# EAGLE design rat (EAGLE 6.3)
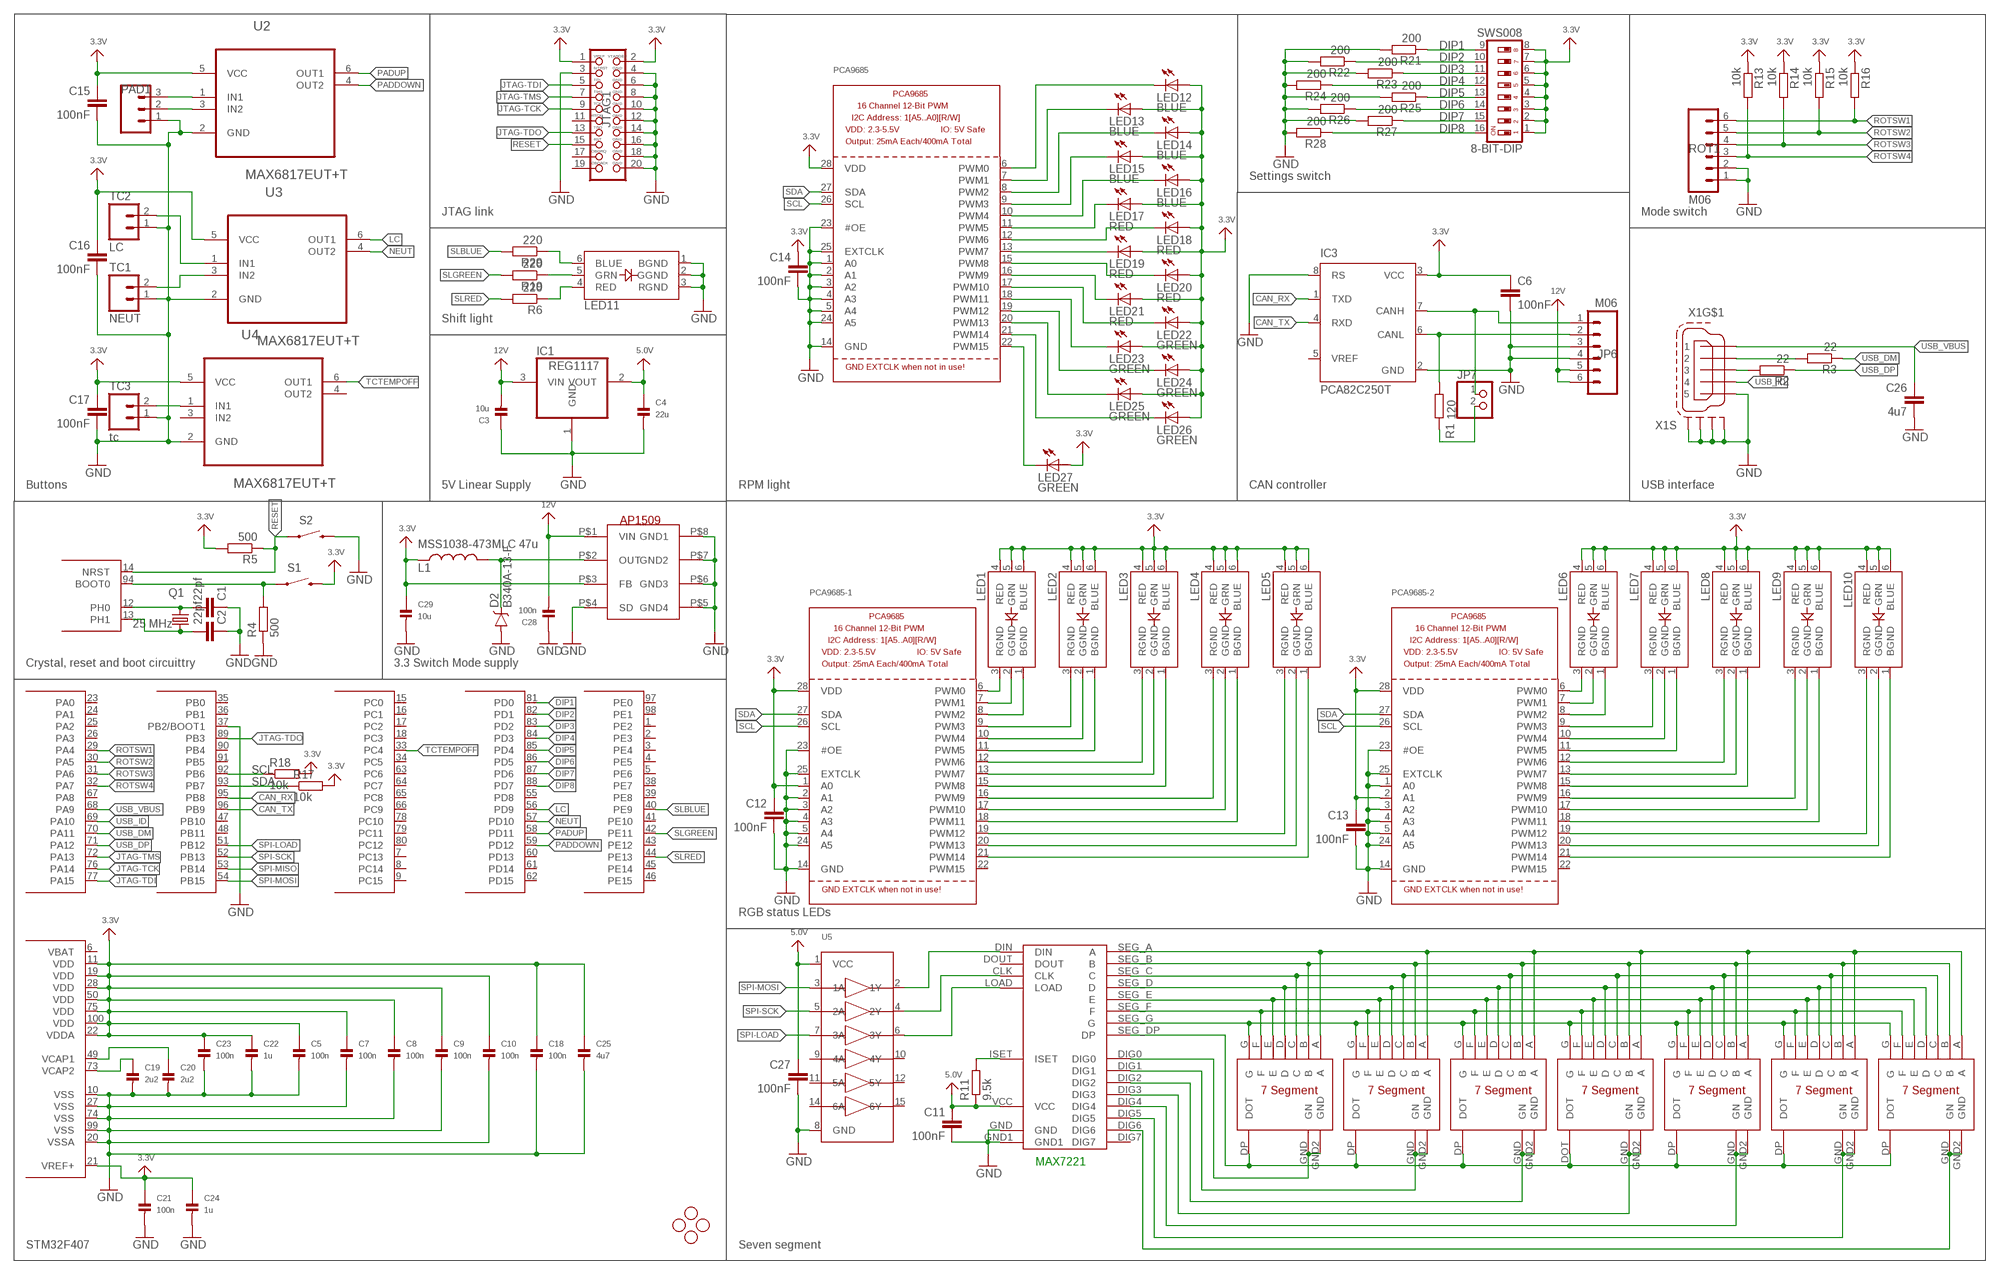
[diagram p0: schematic, sheet 1]

## Parts
8-BIT-DIP  SWS008  [SMS-008]
C1  22pf  C-EUC0603K  [C0603K]
C2  22pf  C-EUC0603K  [C0603K]
C3  10u  CAP_CERAMIC0805  [0805]
C4  22u  CAP_CERAMIC_0603MP  [_0603MP]
C5  100n  CAP_CERAMIC_0402MP  [_0402MP]
C6  100nF  C-EUC0603K  [C0603K]
C7  100n  CAP_CERAMIC_0402MP  [_0402MP]
C8  100n  CAP_CERAMIC_0402MP  [_0402MP]
C9  100n  CAP_CERAMIC_0402MP  [_0402MP]
C10  100n  CAP_CERAMIC_0402MP  [_0402MP]
C11  100nF  C-EUC0603K  [C0603K]
C12  100nF  C-EUC0603K  [C0603K]
C13  100nF  C-EUC0603K  [C0603K]
C14  100nF  C-EUC0603K  [C0603K]
C15  100nF  C-EUC0603K  [C0603K]
C16  100nF  C-EUC0603K  [C0603K]
C17  100nF  C-EUC0603K  [C0603K]
C18  100n  CAP_CERAMIC_0402MP  [_0402MP]
C19  2u2  CAP_CERAMIC_0402MP  [_0402MP]
C20  2u2  CAP_CERAMIC_0402MP  [_0402MP]
C21  100n  CAP_CERAMIC_0402MP  [_0402MP]
C22  1u  CAP_CERAMIC_0402MP  [_0402MP]
C23  100n  CAP_CERAMIC_0402MP  [_0402MP]
C24  1u  CAP_CERAMIC_0402MP  [_0402MP]
C25  4u7  CAP_CERAMIC_0402MP  [_0402MP]
C26  4u7  C-EUC0603K  [C0603K]
C27  100nF  C-EUC0603K  [C0603K]
C28  100n  CAP_CERAMIC_0603MP  [_0603MP]
C29  10u  CAP_CERAMIC0805  [0805]
D2  B340A-13-F  MBRA140  [SMA-DIODE]
IC1  REG1117  [SOT223]
IC3  PCA82C250T  [SO8]
JP2  STAND-OFF  [STAND-OFF]
JP3  STAND-OFF  [STAND-OFF]
JP4  STAND-OFF  [STAND-OFF]
JP5  STAND-OFF  [STAND-OFF]
JP6  M06  [S6B_PH]
JP7  PINHD-1X2/90  [1X02/90]
JTAG1  JTAG-ARMEDGE  [MOLEX20_RIGHTANGLE]
L1  MSS1038-473MLC 47u  INDUCTORPWR  [CDRH125]
LED1  LED_RGB_PLCC6CREE-CLV6A  [RGBLED_PLCC6]
LED2  LED_RGB_PLCC6CREE-CLV6A  [RGBLED_PLCC6]
LED3  LED_RGB_PLCC6CREE-CLV6A  [RGBLED_PLCC6]
LED4  LED_RGB_PLCC6CREE-CLV6A  [RGBLED_PLCC6]
LED5  LED_RGB_PLCC6CREE-CLV6A  [RGBLED_PLCC6]
LED6  LED_RGB_PLCC6CREE-CLV6A  [RGBLED_PLCC6]
LED7  LED_RGB_PLCC6CREE-CLV6A  [RGBLED_PLCC6]
LED8  LED_RGB_PLCC6CREE-CLV6A  [RGBLED_PLCC6]
LED9  LED_RGB_PLCC6CREE-CLV6A  [RGBLED_PLCC6]
LED10  LED_RGB_PLCC6CREE-CLV6A  [RGBLED_PLCC6]
LED11  LED_RGB_PLCC6CREE-CLV6A  [RGBLED_PLCC6]
LED12  BLUE  LEDSMT1206  [1206]
LED13  BLUE  LEDSMT1206  [1206]
LED14  BLUE  LEDSMT1206  [1206]
LED15  BLUE  LEDSMT1206  [1206]
LED16  BLUE  LEDSMT1206  [1206]
LED17  RED  LEDSMT1206  [1206]
LED18  RED  LEDSMT1206  [1206]
LED19  RED  LEDSMT1206  [1206]
LED20  RED  LEDSMT1206  [1206]
LED21  RED  LEDSMT1206  [1206]
LED22  GREEN  LEDSMT1206  [1206]
LED23  GREEN  LEDSMT1206  [1206]
LED24  GREEN  LEDSMT1206  [1206]
LED25  GREEN  LEDSMT1206  [1206]
LED26  GREEN  LEDSMT1206  [1206]
LED27  GREEN  LEDSMT1206  [1206]
MAX7221  MAX7221-SMD  [MAX7221]
PAD1  M03  [S3B-PH]
PCA9685  PCA9685  [TSSOP28]
PCA9685-1  PCA9685  [TSSOP28]
PCA9685-2  PCA9685  [TSSOP28]
Q1  25 MHz  CRYSTALHC49U70  [HC49U70]
R1  120  R-EU_R0603  [R0603]
R2  22  R-EU_R0603  [R0603]
R3  22  R-EU_R0603  [R0603]
R4  500  R-EU_R0603  [R0603]
R5  500  R-EU_R0603  [R0603]
R6  220  R-EU_R0603  [R0603]
R11  9.5k  R-EU_R0603  [R0603]
R13  10k  R-EU_R0603  [R0603]
R14  10k  R-EU_R0603  [R0603]
R15  10k  R-EU_R0603  [R0603]
R16  10k  R-EU_R0603  [R0603]
R17  10k  R-EU_R0603  [R0603]
R18  10k  R-EU_R0603  [R0603]
R19  220  R-EU_R0603  [R0603]
R21  200  R-EU_R0603  [R0603]
R22  200  R-EU_R0603  [R0603]
R23  200  R-EU_R0603  [R0603]
R24  200  R-EU_R0603  [R0603]
R25  200  R-EU_R0603  [R0603]
R26  200  R-EU_R0603  [R0603]
R27  200  R-EU_R0603  [R0603]
R28  200  R-EU_R0603  [R0603]
R29  220  R-EU_R0603  [R0603]
ROT1  M06  [S6B_PH]
S1  SWITCH-MOMENTARY-2-SMD-1101NE  [TACTILE-SWITCH-1101NE]
S2  SWITCH-MOMENTARY-2-SMD-1101NE  [TACTILE-SWITCH-1101NE]
TC1  NEUT  M02-JST-2MM-SMT  [S2B-PH]
TC2  LC  M02-JST-2MM-SMT  [S2B-PH]
TC3  tc  M02-JST-2MM-SMT  [S2B-PH]
U1  STM32F4-100  [SQFP-S-14X14-100]
U2  MAX6817EUT+T  [SOT95P280X145-6N]
U3  MAX6817EUT+T  [SOT95P280X145-6N]
U4  MAX6817EUT+T  [SOT95P280X145-6N]
U5  74HC4050D  [SOIC16]
U$2  REDSEVENSEGMENT  [REDSEGMENT]
U$3  REDSEVENSEGMENT  [REDSEGMENT]
U$4  REDSEVENSEGMENT  [REDSEGMENT]
U$5  BIGSEVENSEGMENT  [BIGSEVENSEGMENT]
U$6  REDSEVENSEGMENT  [REDSEGMENT]
U$7  REDSEVENSEGMENT  [REDSEGMENT]
U$8  REDSEVENSEGMENT  [REDSEGMENT]
U$10  AP1509  [SOP-8L]
X1  MINI-USB-SCHIELD-32005-201  [32005-201]

## Nets
3.3V: 8-BIT-DIP.1 8-BIT-DIP.2 8-BIT-DIP.3 8-BIT-DIP.4 8-BIT-DIP.5 8-BIT-DIP.6 8-BIT-DIP.7 8-BIT-DIP.8 C5.1 C6.1 C7.1 C8.1 C9.1 C10.1 C12.1 C13.1 C14.1 C15.1 C16.1 C17.1 C18.1 C21.1 C22.1 C23.1 C24.1 C25.1 C29.1 IC3.3(VCC) JTAG1.1 JTAG1.2 L1.1 LED1.4(RED) LED1.5(GRN) LED1.6(BLUE) LED2.4(RED) LED2.5(GRN) LED2.6(BLUE) LED3.4(RED) LED3.5(GRN) LED3.6(BLUE) LED4.4(RED) LED4.5(GRN) LED4.6(BLUE) LED5.4(RED) LED5.5(GRN) LED5.6(BLUE) LED6.4(RED) LED6.5(GRN) LED6.6(BLUE) LED7.4(RED) LED7.5(GRN) LED7.6(BLUE) LED8.4(RED) LED8.5(GRN) LED8.6(BLUE) LED9.4(RED) LED9.5(GRN) LED9.6(BLUE) LED10.4(RED) LED10.5(GRN) LED10.6(BLUE) LED12.A LED13.A LED14.A LED15.A LED16.A LED17.A LED18.A LED19.A LED20.A LED21.A LED22.A LED23.A LED24.A LED25.A LED26.A LED27.A PCA9685-1.1(A0) PCA9685-1.28(VDD) PCA9685-2.2(A1) PCA9685-2.28(VDD) PCA9685.28(VDD) R5.2 R13.1 R14.1 R15.1 R16.1 R17.2 R18.2 S1.P$2 U1.11(VDD) U1.19(VDD) U1.21(VREF+) U1.22(VDDA) U1.28(VDD) U1.50(VDD) U1.75(VDD) U1.100(VDD) U2.5(VCC) U3.5(VCC) U4.5(VCC) U$10.P$3(FB)
5.0V: C4.1 C11.1 C27.1 IC1.2(VOUT) MAX7221.VCC R11.1 U5.1(VCC)
12V: C3.2 C28.2 IC1.3(VIN) JP6.5 JP6.6 U$10.P$1(VIN)
CAN_RX: IC3.1(TXD) U1.95(PB8)
CAN_TX: IC3.4(RXD) U1.96(PB9)
CANJUMP1: IC3.7(CANH) JP6.1 JP7.1
CANJUMP2: JP7.2 R1.2
DIP1: 8-BIT-DIP.9 R21.1 U1.81(PD0)
DIP2: 8-BIT-DIP.10 R22.1 U1.82(PD1)
DIP3: 8-BIT-DIP.11 R23.1 U1.83(PD2)
DIP4: 8-BIT-DIP.12 R24.1 U1.84(PD3)
DIP5: 8-BIT-DIP.13 R25.1 U1.85(PD4)
DIP6: 8-BIT-DIP.14 R26.1 U1.86(PD5)
DIP7: 8-BIT-DIP.15 R27.1 U1.87(PD6)
DIP8: 8-BIT-DIP.16 R28.1 U1.88(PD7)
GND: C1.1 C2.1 C3.1 C4.2 C5.2 C6.2 C7.2 C8.2 C9.2 C10.2 C11.2 C12.2 C13.2 C14.2 C15.2 C16.2 C17.2 C18.2 C19.2 C20.2 C21.2 C22.2 C23.2 C24.2 C25.2 C26.2 C27.2 C28.1 C29.2 D2.A IC1.1(GND) IC3.2(GND) IC3.8(RS) JP6.3 JP6.4 JTAG1.3 JTAG1.4 JTAG1.6 JTAG1.8 JTAG1.10 JTAG1.12 JTAG1.14 JTAG1.16 JTAG1.18 JTAG1.20 LED11.1(BGND) LED11.2(GGND) LED11.3(RGND) MAX7221.GND MAX7221.GND1 PAD1.1 PCA9685-1.2(A1) PCA9685-1.3(A2) PCA9685-1.4(A3) PCA9685-1.5(A4) PCA9685-1.14(GND) PCA9685-1.23(#OE) PCA9685-1.24(A5) PCA9685-1.25(EXTCLK) PCA9685-2.1(A0) PCA9685-2.3(A2) PCA9685-2.4(A3) PCA9685-2.5(A4) PCA9685-2.14(GND) PCA9685-2.23(#OE) PCA9685-2.24(A5) PCA9685-2.25(EXTCLK) PCA9685.1(A0) PCA9685.2(A1) PCA9685.3(A2) PCA9685.4(A3) PCA9685.5(A4) PCA9685.14(GND) PCA9685.23(#OE) PCA9685.24(A5) PCA9685.25(EXTCLK) R4.1 R21.2 R22.2 R23.2 R24.2 R25.2 R26.2 R27.2 R28.2 ROT1.1 ROT1.2 S2.P$2 TC1.1 TC2.1 TC3.1 U1.10(VSS) U1.20(VSSA) U1.27(VSS) U1.37(PB2/BOOT1) U1.74(VSS) U1.99(VSS) U2.2(GND) U3.2(GND) U4.2(GND) U5.8(GND) U$10.P$4(SD) U$10.P$5(GND4) U$10.P$6(GND3) U$10.P$7(GND2) U$10.P$8(GND1) X1.5 X1.M1(S:S1) X1.M2(S:S2) X1.M3(S:S3) X1.M4(S:S4)
JTAG-TCK: JTAG1.9 U1.76(PA14)
JTAG-TDI: JTAG1.5 U1.77(PA15)
JTAG-TDO: JTAG1.13 U1.89(PB3)
JTAG-TMS: JTAG1.7 U1.72(PA13)
LC: U1.56(PD9) U3.6(OUT1)
N$1: C2.2 Q1.1 U1.13(PH1)
N$2: C1.2 Q1.2 U1.12(PH0)
N$3: MAX7221.SEG_A(A) U$2.A U$3.A U$4.A U$5.A U$6.A U$7.A U$8.A
N$4: MAX7221.CLK U5.4(2Y)
N$5: MAX7221.LOAD U5.6(3Y)
N$6: MAX7221.SEG_B(B) U$2.B U$3.B U$4.B U$5.B U$6.B U$7.B U$8.B
N$7: MAX7221.DIN U5.2(1Y)
N$8: MAX7221.SEG_C(C) U$2.C U$3.C U$4.C U$5.C U$6.C U$7.C U$8.C
N$9: LED13.C PCA9685.7(PWM1)
N$10: C19.1 U1.73(VCAP2)
N$11: LED14.C PCA9685.8(PWM2)
N$12: MAX7221.SEG_D(D) U$2.D U$3.D U$4.D U$5.D U$6.D U$7.D U$8.D
N$13: MAX7221.SEG_E(E) U$2.E U$3.E U$4.E U$5.E U$6.E U$7.E U$8.E
N$14: MAX7221.SEG_F(F) U$2.F U$3.F U$4.F U$5.F U$6.F U$7.F U$8.F
N$15: MAX7221.SEG_G(G) U$2.G U$3.G U$4.G U$5.G U$6.G U$7.G U$8.G
N$16: MAX7221.DIG0 U$2.GND2(GND) U$2.GND(GN)
N$17: MAX7221.DIG1 U$3.GND2(GND) U$3.GND(GN)
N$18: MAX7221.DIG2 U$4.GND2(GND) U$4.GND(GN)
N$19: MAX7221.DIG3 U$5.GND2(GND) U$5.GND(GN)
N$20: MAX7221.DIG4 U$6.GND2(GND) U$6.GND(GN)
N$21: MAX7221.DIG5 U$7.GND2(GND) U$7.GND(GN)
N$22: MAX7221.DIG6 U$8.GND2(GND) U$8.GND(GN)
N$23: LED15.C PCA9685.9(PWM3)
N$24: C20.1 U1.49(VCAP1)
N$25: MAX7221.SEG_DP(DP) U$2.DP(DOT) U$3.DP(DOT) U$4.DP(DOT) U$5.DOT U$6.DP(DOT) U$7.DP(DOT) U$8.DP(DOT)
N$26: R2.2 X1.3
N$27: MAX7221.ISET R11.2
N$28: R3.2 X1.2
N$29: LED11.5(GRN) R19.1
N$30: R4.2 S1.P$1 U1.94(BOOT0)
N$32: LED11.6(BLUE) R29.1
N$33: LED11.4(RED) R6.1
N$34: LED16.C PCA9685.10(PWM4)
N$35: LED17.C PCA9685.11(PWM5)
N$36: LED18.C PCA9685.12(PWM6)
N$37: LED19.C PCA9685.13(PWM7)
N$38: LED20.C PCA9685.15(PWM8)
N$39: LED21.C PCA9685.16(PWM9)
N$40: LED22.C PCA9685.17(PWM10)
N$41: LED23.C PCA9685.18(PWM11)
N$42: LED24.C PCA9685.19(PWM12)
N$43: LED25.C PCA9685.20(PWM13)
N$44: LED26.C PCA9685.21(PWM14)
N$45: LED1.3(RGND) PCA9685-1.6(PWM0)
N$46: D2.C L1.2 U$10.P$2(OUT)
N$48: LED1.2(GGND) PCA9685-1.7(PWM1)
N$49: LED1.1(BGND) PCA9685-1.8(PWM2)
N$50: LED2.3(RGND) PCA9685-1.9(PWM3)
N$51: IC3.6(CANL) JP6.2 R1.1
N$52: LED2.2(GGND) PCA9685-1.10(PWM4)
N$53: LED2.1(BGND) PCA9685-1.11(PWM5)
N$54: LED3.3(RGND) PCA9685-1.12(PWM6)
N$55: LED3.2(GGND) PCA9685-1.13(PWM7)
N$56: LED3.1(BGND) PCA9685-1.15(PWM8)
N$57: LED4.3(RGND) PCA9685-1.16(PWM9)
N$58: LED12.C PCA9685.6(PWM0)
N$59: LED4.2(GGND) PCA9685-1.17(PWM10)
N$60: LED4.1(BGND) PCA9685-1.18(PWM11)
N$61: LED5.3(RGND) PCA9685-1.19(PWM12)
N$62: LED5.2(GGND) PCA9685-1.20(PWM13)
N$63: LED5.1(BGND) PCA9685-1.21(PWM14)
N$64: LED6.3(RGND) PCA9685-2.6(PWM0)
N$65: LED6.2(GGND) PCA9685-2.7(PWM1)
N$66: LED6.1(BGND) PCA9685-2.8(PWM2)
N$67: LED7.3(RGND) PCA9685-2.9(PWM3)
N$68: LED7.2(GGND) PCA9685-2.10(PWM4)
N$69: LED7.1(BGND) PCA9685-2.11(PWM5)
N$70: LED8.3(RGND) PCA9685-2.12(PWM6)
N$71: LED8.2(GGND) PCA9685-2.13(PWM7)
N$72: LED8.1(BGND) PCA9685-2.15(PWM8)
N$73: LED9.3(RGND) PCA9685-2.16(PWM9)
N$74: LED9.2(GGND) PCA9685-2.17(PWM10)
N$75: LED9.1(BGND) PCA9685-2.18(PWM11)
N$76: LED10.3(RGND) PCA9685-2.19(PWM12)
N$77: LED10.2(GGND) PCA9685-2.20(PWM13)
N$78: LED10.1(BGND) PCA9685-2.21(PWM14)
N$80: LED27.C PCA9685.22(PWM15)
N$85: TC1.2 U3.3(IN2)
N$86: PAD1.3 U2.1(IN1)
N$87: PAD1.2 U2.3(IN2)
N$88: TC2.2 U3.1(IN1)
N$90: TC3.2 U4.1(IN1)
NEUT: U1.57(PD10) U3.4(OUT2)
PADDOWN: U1.59(PD12) U2.4(OUT2)
PADUP: U1.58(PD11) U2.6(OUT1)
RESET: JTAG1.15 R5.1 S2.P$1 U1.14(NRST)
ROTSW1: R16.2 ROT1.6 U1.29(PA4)
ROTSW2: R15.2 ROT1.5 U1.30(PA5)
ROTSW3: R14.2 ROT1.4 U1.31(PA6)
ROTSW4: R13.2 ROT1.3 U1.32(PA7)
SCL: PCA9685-1.26(SCL) PCA9685-2.26(SCL) PCA9685.26(SCL) R18.1 U1.92(PB6)
SDA: PCA9685-1.27(SDA) PCA9685-2.27(SDA) PCA9685.27(SDA) R17.1 U1.93(PB7)
SLBLUE: R29.2 U1.40(PE9)
SLGREEN: R19.2 U1.42(PE11)
SLRED: R6.2 U1.44(PE13)
SPI-LOAD: U1.51(PB12) U5.7(3A)
SPI-MISO: U1.53(PB14)
SPI-MOSI: U1.54(PB15) U5.3(1A)
SPI-SCK: U1.52(PB13) U5.5(2A)
TCTEMPOFF: U1.33(PC4) U4.6(OUT1)
USB_DM: R3.1 U1.70(PA11)
USB_DP: R2.1 U1.71(PA12)
USB_ID: U1.69(PA10) X1.4
USB_VBUS: C26.1 U1.68(PA9) X1.1
Unconnected: IC3.5(VREF) JTAG1.11 JTAG1.17 JTAG1.19 MAX7221.DIG7 MAX7221.DOUT PCA9685-1.22(PWM15) PCA9685-2.22(PWM15) U1.1(PE2) U1.2(PE3) U1.3(PE4) U1.4(PE5) U1.5(PE6) U1.7(PC13) U1.8(PC14) U1.9(PC15) U1.15(PC0) U1.16(PC1) U1.17(PC2) U1.18(PC3) U1.23(PA0) U1.24(PA1) U1.25(PA2) U1.26(PA3) U1.34(PC5) U1.35(PB0) U1.36(PB1) U1.38(PE7) U1.39(PE8) U1.41(PE10) U1.43(PE12) U1.45(PE14) U1.46(PE15) U1.47(PB10) U1.48(PB11) U1.55(PD8) U1.60(PD13) U1.61(PD14) U1.62(PD15) U1.63(PC6) U1.64(PC7) U1.65(PC8) U1.66(PC9) U1.67(PA8) U1.78(PC10) U1.79(PC11) U1.80(PC12) U1.90(PB4) U1.91(PB5) U1.97(PE0) U1.98(PE1) U4.3(IN2) U4.4(OUT2) U5.9(4A) U5.10(4Y) U5.11(5A) U5.12(5Y) U5.14(6A) U5.15(6Y)

## Notes on the sheet
- Settings switch
- JTAG link | Mode switch
- Shift light
- Buttons | 5V Linear Supply | RPM light | CAN controller | USB interface
- Crystal, reset and boot circuittry | 3.3 Switch Mode supply
- RGB status LEDs
- MAX7221
- STM32F407 | Seven segment

## Power pins joined to a net without a drawn wire
VBAT: U1.6(VBAT)

## Library data of the parts
8-BIT-DIP = smd-special:SWS008: SMD Dip Switch 8 pol.
C1 C2 C6 C11-C17 C26 C27 = rcl:C-EU: CAPACITOR, European symbol
C3-C5 C7-C10 C18-C25 C28 C29 = microbuilder:CAP_CERAMIC: Ceramic Capacitors 0402 - 0402 Surface Mount Capacitors 16pF 50V 5% [Digikey: 445-4899-2-ND] 18pF 50V 5% [Digikey: 490-1281-2-ND] 22pF 50V 5% [Digikey: 490-1283-2-ND] 68pF 50V 5% [Digikey: 490-1289-2-ND] 0.1uF 10V 10% [Digikey: 490-1318-2-ND] 1.0uF 6.3V 10% [Digikey: 490-1320-2-ND] 0603 - 0603 Surface Mount Capacitors 16 pF 50V 5% [Digikey: 445-5051-2-ND] 22 pF 50V [Digikey: PCC220ACVTR-ND] 33 pF 50V 5% [Digikey: 490-1415-1-ND] 56pF 50V 5% [Digikey: 490-1421-1-ND] 220pF 50V 5% [Digikey: 445-1285-1-ND] 680 pF 50V 2200 pF 50V 5% C0G [Digikey: 445-1297-1-ND] 5600 pF 100V 5% X7R [Digikey: 478-3711-1-ND] 0.1 µF 25V 10% [Digikey: PCC2277TR-ND] 0.22 µF 16V 10% X7R [Digikey: 445-1318-1-ND] 1.0 µF 25V 10% [Digikey: 445-5146-2-ND] 0603 - RF Specific 3pF 250V +/-0.1pF RF [Digikey: 712-1347-1-ND] 18 pF 250V 5% [Digikey: 478-3505-1-ND or 712-1322-1-ND] 56 pF 250V 5% C0G RF [Digikey: 490-4867-1-ND] 68 pF 250V RF [Digikey: 490-4868-1-ND] 0805 - 0805 Surface Mount Capacitors 220 pF 250V 2% RF Ceramic Capacitor [Digikey: 712-1398-1-ND] 1000 pF 50V 2% NP0 Ceramic Capacitor [Digikey: 478-3760-1-ND] 0.1 µF 25V 10% Ceramic Capacitor [Digikey: PCC1828TR-ND] 1.0 µF 16V 10% Ceramic Capacitor[Digikey: 490-1691-2-ND] 10.0 µF 10V 10% Ceramic Capacitor[Digikey: 709-1228-1-ND] 10.0 uF 16V 10% Ceramic Capacitor [Digikey: 478-5165-2-ND] 47 uF 6.3V 20% Ceramic Capacitor [Digikey: 587-1779-1-ND or 399-5506-1-ND] 1206 - 1206 Surface Mount Capacitors 47uF 10V 20% Ceramic Capacitor [Digikey: 490-5528-1-ND or 399-5508-1-ND or 445-6010-1-ND] 100uF 6.3V -20%, +80% Y5V Ceramic Capacitor (Digikey: 490-4512-1-ND, Mouser: 81-GRM31CF50J107ZE1L)
D2 = SparkFun-DiscreteSemi:MBRA140: 40V, 1A Schottky rectifier SMA/DO-214AC package DIO-08053; PROD_ID: DIO-08053
IC1 = burr-brown:REG1117: 800mA and 1A Low Dropout (LDO) Positive Regulator 1.8V, 2.5V, 2.85V, 3.3V, 5V, and Adj; MPN: REG1117; OC_FARNELL: 1097566; OC_NEWARK: 14P6981
IC3 = micro-philips:PCA82C250: CAN CONTROLLER INTERFACE; OC_FARNELL: 1085275; OC_NEWARK: unknown
JP2-JP5 = SparkFun:STAND-OFF: Stand Off This is the mechanical footprint for a #4 phillips button head screw. Use the keepout ring to avoid running the screw head into surrounding components. SKU : PRT-00447
JP6 ROT1 = unicorn_v2:M06
JP7 = pinhead:PINHD-1X2: PIN HEADER
JTAG1 = microbuilder:JTAG-ARM: 20 Pin JTAG Connector For use with ARM7, and ARM9. Supported by some Cortex M3 boards with SWJ-DP interfaces (dual SWP/JTAG support). 4UConnector: 03556
L1 = SparkFun-Passives:INDUCTOR: Inductors Basic Inductor/Choke - 0603 and 1206. Footprints are not proven and vary greatly between part numbers. SRN6045- 33uH, 20% 1.4A SDR0403-560KL - 56uH, 10%, 500mA RMS/740mA peak
LED1-LED11 = microbuilder:LED_RGB_PLCC6: RGB LED Cree CLV6A-FKB - Digikey: CLV6A-FKB-CK1P1G1BB7R3R3TR-ND DC Foreward Current: 20mA Foreward Voltage: R = 2.0, G = 3.2, B = 3.2 Viewing Angle: 120°
LED12-LED27 = led:LED: LED OSRAM: - CHIPLED LG R971, LG N971, LY N971, LG Q971, LY Q971, LO R971, LY R971 LH N974, LH R974 LS Q976, LO Q976, LY Q976 LO Q996 - Hyper CHIPLED LW Q18S LB Q993, LB Q99A, LB R99A - SideLED LS A670, LO A670, LY A670, LG A670, LP A670 LB A673, LV A673, LT A673, LW A673 LH A674 LY A675 LS A676, LA A676, LO A676, LY A676, LW A676 LS A679, LY A679, LG A679 - Hyper Micro SIDELED® LS Y876, LA Y876, LO Y876, LY Y876 LT Y87S - SmartLED LW L88C, LW L88S LB L89C, LB L89S, LG L890 LS L89K, LO L89K, LY L89K LS L896, LA L896, LO L896, LY L896 - TOPLED LS T670, LO T670, LY T670, LG T670, LP T670 LSG T670, LSP T670, LSY T670, LOP T670, LYG T670 LG T671, LOG T671, LSG T671 LB T673, LV T673, LT T673, LW T673 LH T674 LS T676, LA T676, LO T676, LY T676, LB T676, LH T676, LSB T676, LW T676 LB T67C, LV T67C, LT T67C, LS T67K, LO T67K, LY T67K, LW E67C LS E67B, LA E67B, LO E67B, LY E67B, LB E67C, LV E67C, LT E67C LW T67C LS T679, LY T679, LG T679 LS T770, LO T770, LY T770, LG T770, LP T770 LB T773, LV T773, LT T773, LW T773 LH T774 LS E675, LA E675, LY E675, LS T675 LS T776, LA T776, LO T776, LY T776, LB T776 LHGB T686 LT T68C, LB T68C - Hyper Mini TOPLED® LB M676 - Mini TOPLED Santana® LG M470 LS M47K, LO M47K, LY M47K Source: http://www.osram.convergy.de LUXEON: - LUMILED® LXK2-PW12-R00, LXK2-PW12-S00, LXK2-PW14-U00, LXK2-PW14-V00 LXK2-PM12-R00, LXK2-PM12-S00, LXK2-PM14-U00 LXK2-PE12-Q00, LXK2-PE12-R00, LXK2-PE12-S00, LXK2-PE14-T00, LXK2-PE14-U00 LXK2-PB12-K00, LXK2-PB12-L00, LXK2-PB12-M00, LXK2-PB14-N00, LXK2-PB14-P00, LXK2-PB14-Q00 LXK2-PR12-L00, LXK2-PR12-M00, LXK2-PR14-Q00, LXK2-PR14-R00 LXK2-PD12-Q00, LXK2-PD12-R00, LXK2-PD12-S00 LXK2-PH12-R00, LXK2-PH12-S00 LXK2-PL12-P00, LXK2-PL12-Q00, LXK2-PL12-R00 Source: www.luxeon.com KINGBRIGHT: KA-3528ASYC Source: www.kingbright.com; OSRAM-LGN971: GREEN
MAX7221 = max7221-smd:MAX7221-SMD
PAD1 = unicorn_v2:M03: Header 2 Standard 2-pin 0.1" header. Use with straight break away headers (SKU : PRT-00116), right angle break away headers (PRT-00553), swiss pins (PRT-00743), machine pins (PRT-00117), and female headers (PRT-00115). Molex polarized connector foot print use with SKU : PRT-08233 with associated crimp pins and housings.
PCA9685 PCA9685-1 PCA9685-2 = adafruit:PCA9685: PCA9685 - 16 Channel 12-Bit I2C PWM Controller 5.0V tolerant 16 channel, 12-bit I2C PWM controller with 25mA per output (max. 400mA total) Digikey: 568-5931-1-ND
Q1 = crystal:CRYSTAL: CRYSTAL; OC_FARNELL: unknown; OC_NEWARK: unknown
R1 = resistor:R-EU_: RESISTOR, European symbol
R2-R6 R11 R13-R19 R21-R29 = rcl:R-EU_: RESISTOR, European symbol
S1 S2 = SparkFun-Electromechanical:SWITCH-MOMENTARY-2: Various NO switches- pushbuttons, reed, etc
TC1-TC3 = unicorn_v2:M02: Header 2 Standard 2-pin 0.1" header. Use with straight break away headers (SKU : PRT-00116), right angle break away headers (PRT-00553), swiss pins (PRT-00743), machine pins (PRT-00117), and female headers (PRT-00115). Molex polarized connector foot print use with SKU : PRT-08233 with associated crimp pins and housings.
U1 = apbteam_stm32:STM32F4-100: STM32F4, 100 pin package According to STM32F40x datasheet, almost compatible with STM32F4xx, STM32F2xx, some pins must be connected differently, see chapter 2.1.
U2-U4 = Maxim_By_element14_Batch_1:MAX6817EUT+T: ±15kV ESD-Protected CMOS Switch Debouncers; MPN: MAX6817EUT+T; OC_FARNELL: 1299771; OC_NEWARK: 68K9458; PACKAGE: SOT23-6; SUPPLIER: Maxim
U5 = microbuilder:74HC4050D: 6-channel level shifter 74HC4050D - 2V-6V Supply Digikey: 74HC4050D,653-ND Mouser: 771-74HC4050D-T
U$2-U$4 U$6-U$8 = red_segment:REDSEVENSEGMENT
U$5 = red_segment:BIGSEVENSEGMENT
U$10 = unicorn_v2:AP1509
X1 = con-cypressindustries:MINI-USB-SCHIELD-: MINI USB-B Conector Source: www.cypressindustries.com; OC_FARNELL: unknown; OC_NEWARK: unknown

## Board
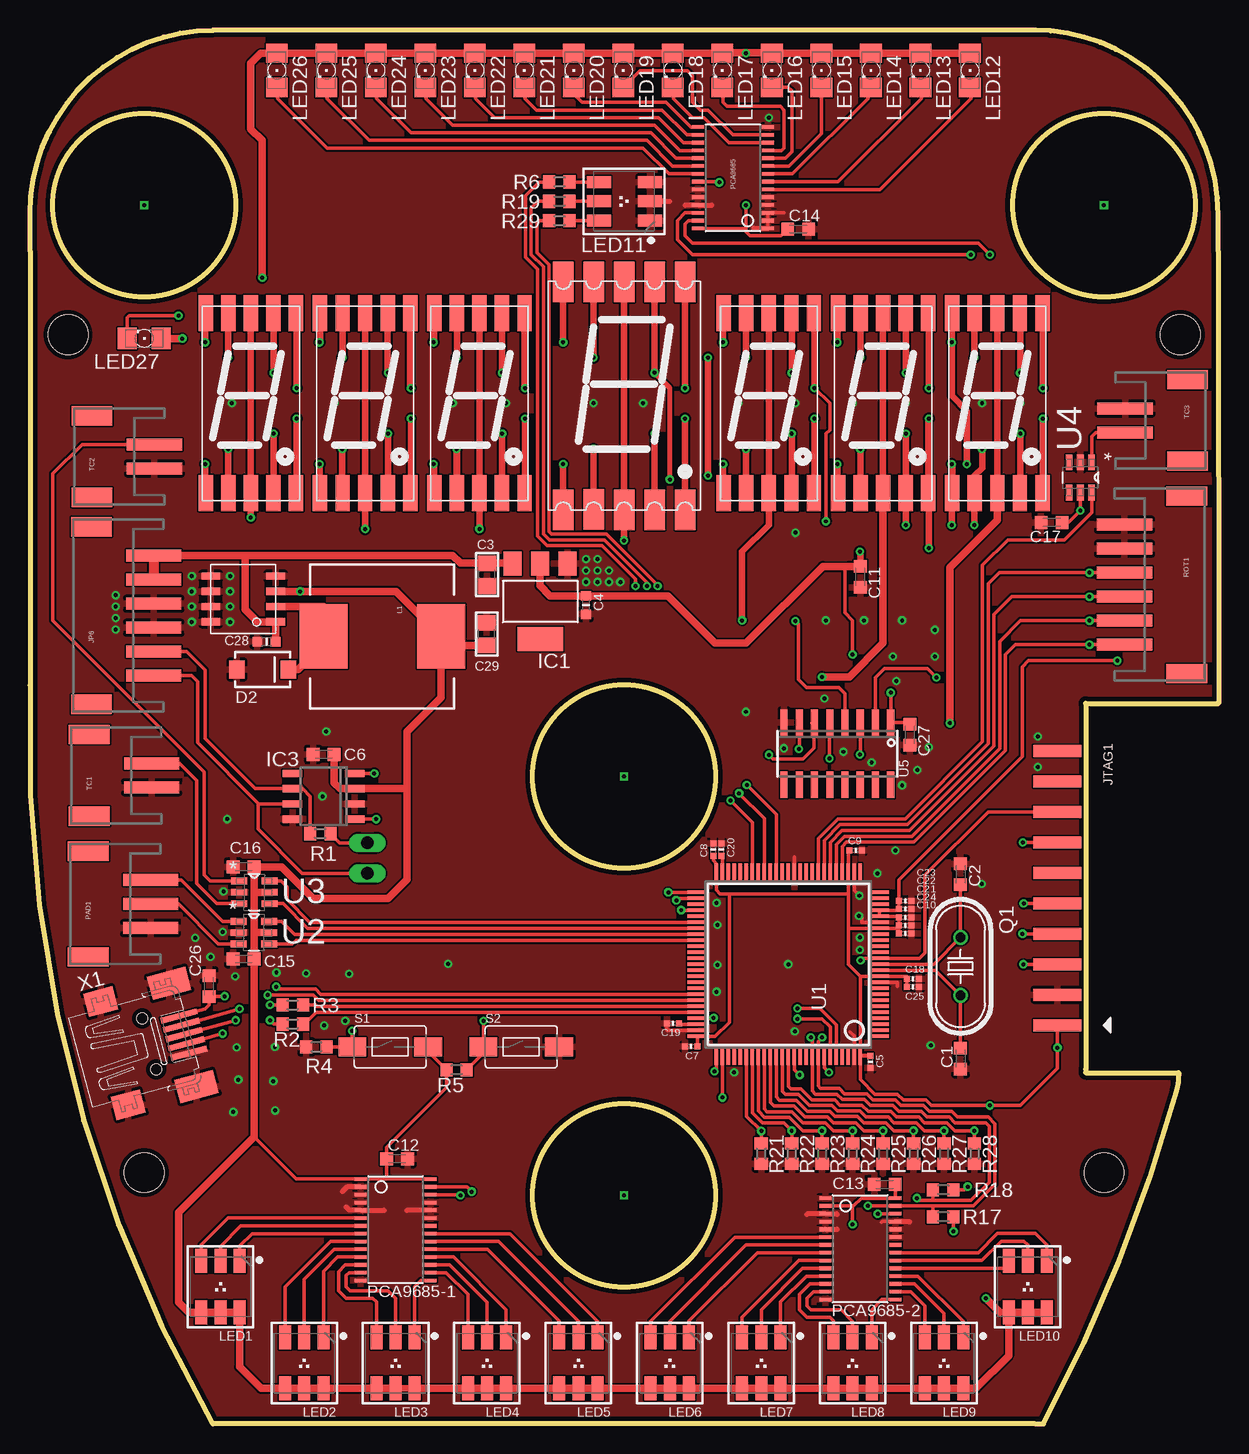
[diagram p1: board, top side]
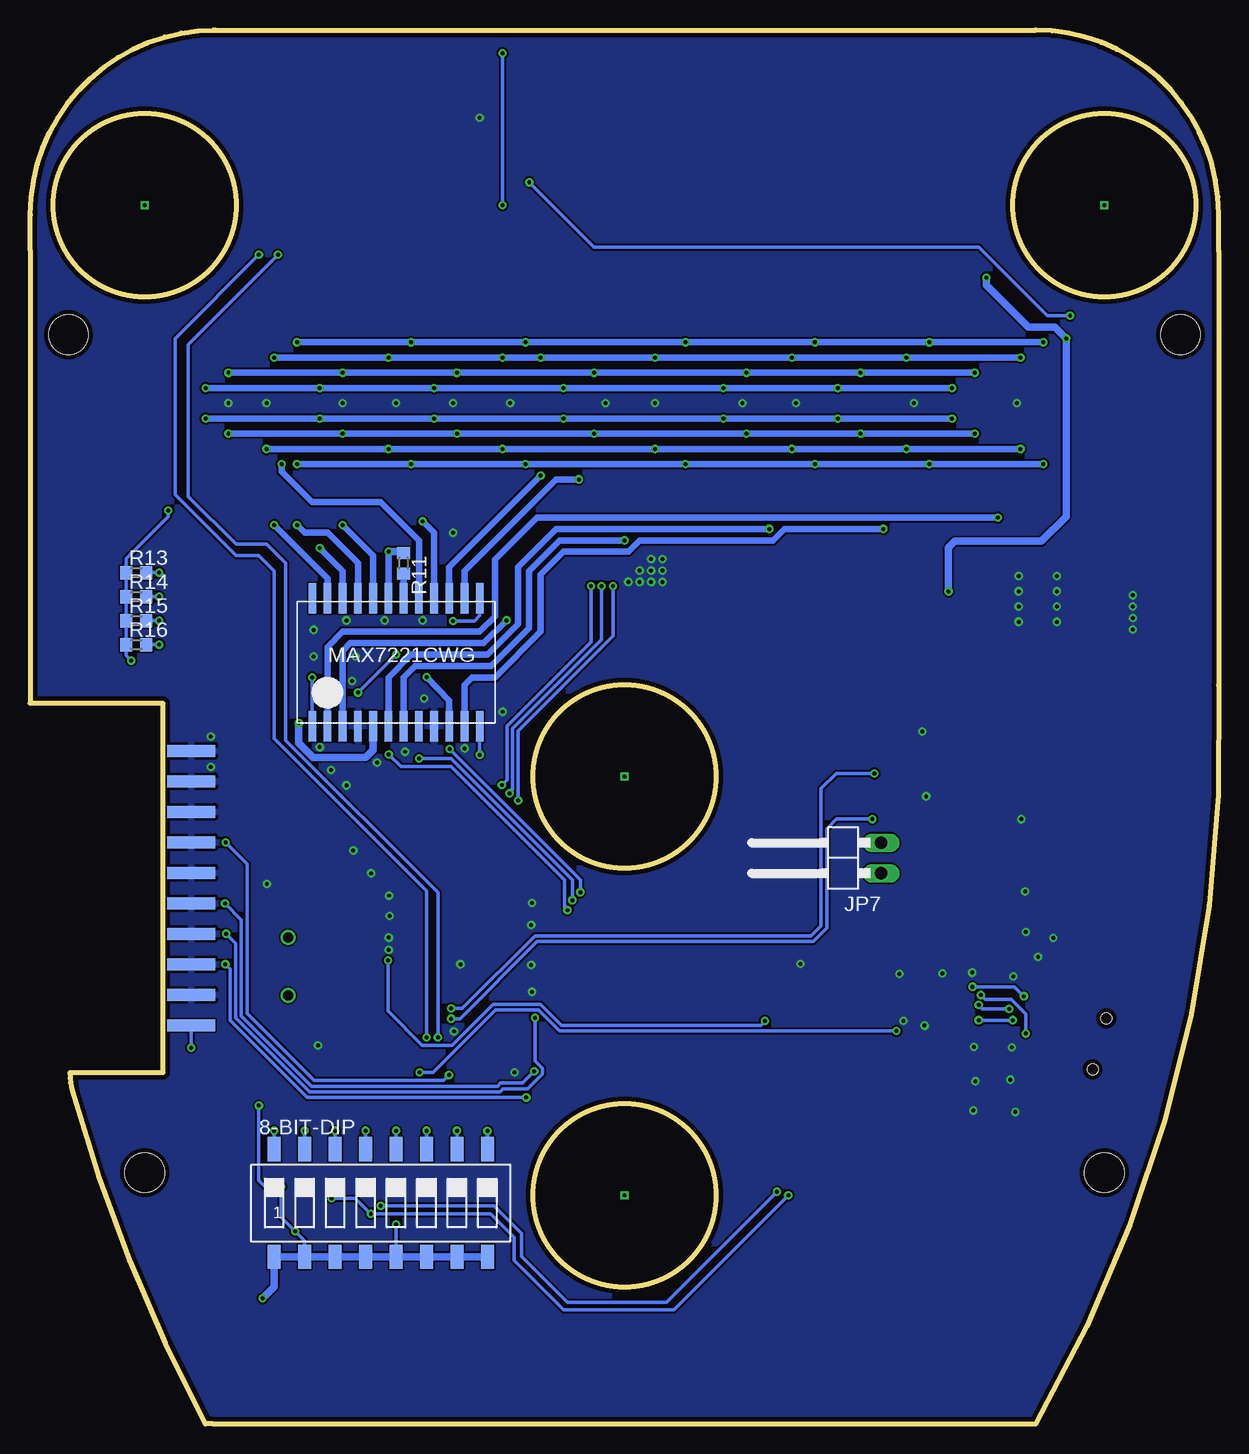
[diagram p2: board, bottom side, seen from below]

Size 99.09 x 116.2 mm. Coordinates in mm from the lower left corner, seen from the top.
Outline: 83.82,116.2 83.65,116.2
Outline: 83.65,116.2 15.31,116.2
Outline: 15.31,116.2 15.24,116.2
Outline: 83.82,0 15.24,0 arc-32 0,61.59 0,97.79
Outline: 99.06,97.79 99.09,60.07 88.01,60.07
Outline: 0,97.82 0,100.89 arc-90 15.31,116.2
Outline: 99.06,97.8 99.06,100.8 arc90 83.65,116.2
Outline: 88.01,60.06 88.01,29.27
Outline: 88.01,29.59 88.01,29.27
Outline: 88.01,29.27 95.76,29.27 95.76,29.18 arc-16 95.57,27.78 arc-12 84.49,0 83.85,0
Outline: circle at 9.53,101.6 radius 7.62
Outline: circle at 89.53,101.6 radius 7.62
Outline: circle at 49.53,53.98 radius 7.62
Outline: circle at 49.53,19.05 radius 7.62
Copper layers (1*16): Top 0.0356mm / dielectric 1.5011mm / Bottom 0.0356mm
Design rules "LaenPCBOrder": minimum track width 6mil, minimum drill 13mil, track to track 6mil, track to pad 6mil, pad to pad 6mil, via to via 6mil, smd to smd 6mil, copper to edge 15mil, drill to drill 6mil, minimum pad ring 7mil, minimum via ring 7mil, stop-mask expansion 3mil, vias tented up to drill 0mil, thermal gap 10mil

### Footprints (pad centres in the part's own frame; a part is rotated, then mirrored left to right if it is on the bottom)
SMS-008 = smd 1.092 x 2.007: 1 -8.89,-4.496; 2 -6.35,-4.496; 3 -3.81,-4.496; 4 -1.27,-4.496; 5 1.27,-4.496; 6 3.81,-4.496; 7 6.35,-4.496; 8 8.89,-4.496; 9 8.89,4.496; 10 6.35,4.496; 11 3.81,4.496; 12 1.27,4.496; 13 -1.27,4.496; 14 -3.81,4.496; 15 -6.35,4.496; 16 -8.89,4.496
C0603K = smd 1.05 x 1.08: 1 -0.875,0; 2 0.875,0
0805 = smd 1.3 x 1.5: 1 -0.95,0; 2 0.95,0
_0603MP = smd 0.8 x 0.8: 1 -0.762,0; 2 0.762,0
_0402MP = smd 0.5 x 0.5: 1 -0.508,0; 2 0.508,0
SMA-DIODE = smd 1.27 x 1.47: A -2.15,0; C 2.15,0
SOT223 = smd 1.499 x 2.007: 1 -2.261,-3.15; 2 0.025,-3.15; 3 2.311,-3.15 | smd 3.81 x 2.007: 4 0,3.15
SO8 = smd 0.6 x 1.6: 1 -1.905,-2.6; 2 -0.635,-2.6; 3 0.635,-2.6; 4 1.905,-2.6; 5 1.905,2.6; 6 0.635,2.6; 7 -0.635,2.6; 8 -1.905,2.6
STAND-OFF = hole 3.302: 0,0
S6B_PH = smd 1 x 4.6: 1 -4.92,-2.7; 2 -2.92,-2.7; 3 -0.92,-2.7; 4 1.08,-2.7; 5 3.08,-2.7; 6 5.08,-2.7 | smd 1.6 x 3.4: NC1 -7.32,2.5; NC2 7.48,2.5
1X02/90 = drill 1.016 long: 1 -1.27,-3.81; 2 1.27,-3.81
MOLEX20_RIGHTANGLE = smd 1 x 4: 1 11.43,0; 3 8.89,0; 5 6.35,0; 7 3.81,0; 9 1.27,0; 11 -1.27,0; 13 -3.81,0; 15 -6.35,0; 17 -8.89,0; 19 -11.43,0 | smd 1 x 4 bottom: 2 11.43,0; 4 8.89,0; 6 6.35,0; 8 3.81,0; 10 1.27,0; 12 -1.27,0; 14 -3.81,0; 16 -6.35,0; 18 -8.89,0; 20 -11.43,0
CDRH125 = smd 5.4 x 4: 1 0,4.9; 2 0,-4.9
RGBLED_PLCC6 = smd 1 x 2: 1 -1.6,-2.158; 2 0,-2.158; 3 1.6,-2.158; 4 1.6,2.108; 5 0,2.108; 6 -1.6,2.108
1206 = smd 1.6 x 1.803: A -1.422,0; C 1.422,0
MAX7221 = smd 0.635 x 2.54: CLK 7.62,5.325; DIG0 -5.08,-5.325; DIG1 6.35,-5.325; DIG2 0,-5.325; DIG3 1.27,-5.325; DIG4 -3.81,-5.325; DIG5 5.08,-5.325; DIG6 -1.27,-5.325; DIG7 2.54,-5.325; DIN -6.35,-5.325; DOUT -6.35,5.325; GND -2.54,-5.325; GND1 3.81,-5.325; ISET 1.27,5.325; LOAD 7.62,-5.325; SEG_A 6.35,5.325; SEG_B 3.81,5.325; SEG_C -1.27,5.325; SEG_D -5.08,5.325; SEG_DP -3.81,5.325; SEG_E -2.54,5.325; SEG_F 5.08,5.325; SEG_G 2.54,5.325; VCC 0,5.325
S3B-PH = smd 1 x 4.6: 1 -2,-2.43; 2 0,-2.43; 3 2,-2.43 | smd 1.6 x 3.4: NC1 -4.4,2.77; NC2 4.4,2.77
TSSOP28 = smd 0.305 x 0.991: 1 -4.225,-2.918; 2 -3.575,-2.918; 3 -2.925,-2.918; 4 -2.275,-2.918; 5 -1.625,-2.918; 6 -0.975,-2.918; 7 -0.325,-2.918; 8 0.325,-2.918; 9 0.975,-2.918; 10 1.625,-2.918; 11 2.275,-2.918; 12 2.925,-2.918; 13 3.575,-2.918; 14 4.225,-2.918; 15 4.225,2.918; 16 3.575,2.918; 17 2.925,2.918; 18 2.275,2.918; 19 1.625,2.918; 20 0.975,2.918; 21 0.325,2.918; 22 -0.325,2.918; 23 -0.975,2.918; 24 -1.625,2.918; 25 -2.275,2.918; 26 -2.925,2.918; 27 -3.575,2.918; 28 -4.225,2.918
HC49U70 = drill 0.813: 1 -2.413,0; 2 2.413,0
R0603 = smd 1 x 1.1: 1 -0.85,0; 2 0.85,0
TACTILE-SWITCH-1101NE = smd 2.3 x 1.6: P$1 -3.15,0; P$2 3.15,0
S2B-PH = smd 1 x 4.6: 1 -1,-3.7; 2 1,-3.7 | smd 1.6 x 3.4: NC1 -3.4,1.5; NC2 3.4,1.5
SQFP-S-14X14-100 = smd 0.3 x 1.6: 1 -6,-7.6; 2 -5.5,-7.6; 3 -5,-7.6; 4 -4.5,-7.6; 5 -4,-7.6; 6 -3.5,-7.6; 7 -3,-7.6; 8 -2.5,-7.6; 9 -2,-7.6; 10 -1.5,-7.6; 11 -1,-7.6; 12 -0.5,-7.6; 13 0,-7.6; 14 0.5,-7.6; 15 1,-7.6; 16 1.5,-7.6; 17 2,-7.6; 18 2.5,-7.6; 19 3,-7.6; 20 3.5,-7.6; 21 4,-7.6; 22 4.5,-7.6; 23 5,-7.6; 24 5.5,-7.6; 25 6,-7.6; 51 6,7.6; 52 5.5,7.6; 53 5,7.6; 54 4.5,7.6; 55 4,7.6; 56 3.5,7.6; 57 3,7.6; 58 2.5,7.6; 59 2,7.6; 60 1.5,7.6; 61 1,7.6; 62 0.5,7.6; 63 0,7.6; 64 -0.5,7.6; 65 -1,7.6; 66 -1.5,7.6; 67 -2,7.6; 68 -2.5,7.6; 69 -3,7.6; 70 -3.5,7.6; 71 -4,7.6; 72 -4.5,7.6; 73 -5,7.6; 74 -5.5,7.6; 75 -6,7.6 | smd 1.6 x 0.3: 26 7.6,-6; 27 7.6,-5.5; 28 7.6,-5; 29 7.6,-4.5; 30 7.6,-4; 31 7.6,-3.5; 32 7.6,-3; 33 7.6,-2.5; 34 7.6,-2; 35 7.6,-1.5; 36 7.6,-1; 37 7.6,-0.5; 38 7.6,0; 39 7.6,0.5; 40 7.6,1; 41 7.6,1.5; 42 7.6,2; 43 7.6,2.5; 44 7.6,3; 45 7.6,3.5; 46 7.6,4; 47 7.6,4.5; 48 7.6,5; 49 7.6,5.5; 50 7.6,6; 76 -7.6,6; 77 -7.6,5.5; 78 -7.6,5; 79 -7.6,4.5; 80 -7.6,4; 81 -7.6,3.5; 82 -7.6,3; 83 -7.6,2.5; 84 -7.6,2; 85 -7.6,1.5; 86 -7.6,1; 87 -7.6,0.5; 88 -7.6,0; 89 -7.6,-0.5; 90 -7.6,-1; 91 -7.6,-1.5; 92 -7.6,-2; 93 -7.6,-2.5; 94 -7.6,-3; 95 -7.6,-3.5; 96 -7.6,-4; 97 -7.6,-4.5; 98 -7.6,-5; 99 -7.6,-5.5; 100 -7.6,-6
SOT95P280X145-6N = smd 1.321 x 0.559: 1 -1.27,0.94; 2 -1.27,0; 3 -1.27,-0.94; 4 1.27,-0.94; 5 1.27,0; 6 1.27,0.94
SOIC16 = smd 0.6 x 2.2: 1 -4.445,-2.6; 2 -3.175,-2.6; 3 -1.905,-2.6; 4 -0.635,-2.6; 5 0.635,-2.6; 6 1.905,-2.6; 7 3.175,-2.6; 8 4.445,-2.6; 9 4.445,2.6; 10 3.175,2.6; 11 1.905,2.6; 12 0.635,2.6; 13 -0.635,2.6; 14 -1.905,2.6; 15 -3.175,2.6; 16 -4.445,2.6
REDSEGMENT = smd 1.2 x 3: A 1.88,7.5; B 3.76,7.5; C 1.88,-7.5; D -1.88,-7.5; DP 3.76,-7.5; E -3.76,-7.5; F -1.88,7.5; G -3.76,7.5; GND 0,-7.5; GND2 0,7.5
BIGSEVENSEGMENT = smd 1.7 x 3.4: A 2.54,9.475; B 5.08,9.475; C 2.54,-9.525; D -2.54,-9.475; DOT 5.08,-9.525; E -5.08,-9.525; F -2.54,9.475; G -5.08,9.475; GND 0,9.475; GND2 0,-9.525
SOP-8L = smd 0.6 x 1.55: P$1 -1.905,-2.54; P$2 -0.635,-2.54; P$3 0.635,-2.54; P$4 1.905,-2.54; P$5 1.905,2.86; P$6 0.635,2.86; P$7 -0.635,2.86; P$8 -1.905,2.86
32005-201 = smd 3.1 x 0.5: 1 3,1.6; 2 3,0.8; 3 3,0; 4 3,-0.8; 5 3,-1.6 | smd 2.5 x 2: M1 -3,-4.45; M2 -3,4.45 | smd 3.3 x 2: M3 2.9,4.45; M4 2.9,-4.45 | hole 0.9: 0,2.2; 0,-2.2

### Placement (x,y rotation side)
8-BIT-DIP  69.85,18.41 0 bottom
C1  77.58,30.46 90 top
C2  77.58,45.81 270 top
C3  38.1,70.8 90 top
C4  46.35,68.26 270 top
C5  70.07,30.19 270 top
C6  24.48,55.82 180 top
C7  55.12,31.46 180 top
C8  56.96,47.88 90 top
C9  68.83,47.82 0 top
C10  72.96,40.89 0 top
C11  69.22,70.62 270 top
C12  30.6,22.11 0 top
C13  71.25,19.96 180 top
C14  64.04,99.6 0 top
C15  17.81,38.77 180 top
C16  17.81,46.45 180 top
C17  85.15,75.15 180 top
C18  73.6,37.12 0 top
C19  53.59,33.4 180 top
C20  57.63,47.88 90 top
C21  72.96,42.23 0 top
C22  72.96,42.93 0 top
C23  72.96,43.59 0 top
C24  72.96,41.56 0 top
C25  73.6,36.45 0 top
C26  14.92,36.51 90 top
C27  73.34,57.47 270 top
C28  19.72,65.21 0 top
C29  38.07,65.85 90 top
D2  19.4,62.9 0 top
IC1  42.54,68.58 180 top
IC3  24.48,52.32 90 top
JP2  89.53,20.95 0 top
JP3  9.53,20.95 0 top
JP4  95.89,90.81 0 top
JP5  3.17,90.81 0 top
JP6  7.62,67.31 90 top
JP7  31.94,47.18 90 bottom
JTAG1  85.66,44.67 270 top
L1  29.37,65.66 270 top
LED1  15.88,11.43 180 top
LED2  22.86,5.08 180 top
LED3  30.48,5.08 180 top
LED4  38.1,5.08 180 top
LED5  45.72,5.08 180 top
LED6  53.34,5.08 180 top
LED7  60.96,5.08 180 top
LED8  68.58,5.08 180 top
LED9  76.2,5.08 180 top
LED10  83.19,11.43 180 top
LED11  49.53,101.92 90 top
LED12  78.36,112.84 270 top
LED13  74.23,112.84 270 top
LED14  70.1,112.84 270 top
LED15  65.98,112.84 270 top
LED16  61.85,112.84 270 top
LED17  57.72,112.84 270 top
LED18  53.59,112.84 270 top
LED19  49.47,112.84 270 top
LED20  45.34,112.84 270 top
LED21  41.21,112.84 270 top
LED22  37.08,112.84 270 top
LED23  32.96,112.84 270 top
LED24  28.83,112.84 270 top
LED25  24.7,112.84 270 top
LED26  20.57,112.84 270 top
LED27  9.53,90.49 180 top
MAX7221  69.22,63.5 0 bottom
PAD1  7.62,43.34 90 top
PCA9685  58.61,103.89 90 top
PCA9685-1  30.48,16.19 270 top
PCA9685-2  69.22,14.61 270 top
Q1  77.57,38.14 270 top
R1  24.19,49.21 0 top
R2  21.91,33.34 180 top
R3  21.91,34.92 180 top
R4  23.88,31.43 0 top
R5  35.56,29.53 180 top
R6  44.13,103.54 180 top
R11  67.94,71.75 270 bottom
R13  90.23,70.96 0 bottom
R14  90.23,68.96 0 bottom
R15  90.23,66.96 0 bottom
R16  90.23,64.96 0 bottom
R17  76.14,17.27 0 top
R18  76.14,19.53 0 top
R19  44.13,101.92 180 top
R21  60.96,22.54 270 top
R22  63.5,22.54 270 top
R23  66.04,22.54 270 top
R24  68.58,22.54 270 top
R25  71.12,22.54 270 top
R26  73.66,22.54 270 top
R27  76.2,22.54 270 top
R28  78.74,22.54 270 top
R29  44.13,100.3 180 top
ROT1  93.95,70.04 270 top
S1  30.04,31.43 0 top
S2  40.96,31.43 0 top
TC1  6.45,54.07 90 top
TC2  6.67,80.65 90 top
TC3  95,83.66 270 top
U1  63.21,38.32 90 top
U2  18.67,40.96 0 top
U3  18.7,44.32 0 top
U4  87.57,78.9 270 top
U5  67.31,55.88 180 top
U$2  18.41,85.09 0 top
U$3  27.94,85.09 0 top
U$4  37.47,85.09 0 top
U$5  49.53,85.72 0 top
U$6  61.59,85.09 0 top
U$7  71.12,85.09 0 top
U$8  80.64,85.09 0 top
U$10  17.94,68.77 90 top
X1  9.94,31.69 15 top

### Tracks (layer width: path | path; a pad name or v marks a point on that pad's centre or on a via)
3.3V  (via drill 0.33)
  Top 0.305: 72.98,37.32 C18.1 | C18.1 C25.1 | U1.50 | U1.50 57.21,46.7 56.96,46.96 C8.1 | C7.1 55.63,32.31 U1.75 57.12,32.32 58.29,33.5 58.29,44.2 | U1.100 | C24.1 C21.1 72.39,42.32 U1.21 U1.22 72.38,42.82 C22.1 C23.1 72.45,45.34 82.74,55.63 82.74,63.12 83.25,63.63 v90.65,63.63 | C24.1 C10.1 | U4.5 v87.57,76.14 86.58,75.15 C17.1 | 29.73,20.42 PCA9685-1.1 22.2,20.42 18.69,23.93 | 29.73,20.42 PCA9685-1.28 | 29.73,20.42 C12.1 29.73,23.06 34.71,28.04 R5.2 33.19,31.05 S1.P$2 | PCA9685-2.2 68.58,18.18 | v68.58,16.64 68.58,18.18 | 68.58,18.18 68.66,18.18 69.31,18.83 PCA9685-2.28 C13.1 | R17.2 76.99,16.22 v76.99,16.07 | R18.2 77.91,19.53 v78.17,19.78 | C14.1 62.62,99.06 60.01,99.06 59.69,99.38 59.69,99.66 | v59.69,101.6 59.69,99.66 | PCA9685.28 59.69,99.66 | 68.21,44.16 U1.28 68.21,47.83 C9.1 | U1.50 57.21,44.51 57.53,44.2 58.29,44.2 | 58.29,44.2 68.18,44.2 68.21,44.16 | U1.100 70.05,30.72 C5.1 69.22,30.7 69.22,28.73 70.45,27.5 72.33,27.5 72.8,27.02 74.68,27.02 75.15,26.54 v80.01,26.54 82.55,26.54 85.66,29.66 v85.66,31.37 JTAG1.2 | U1.100 69.22,37.32 | 69.22,37.32 U1.11 73.09,37.32 C18.1 | 69.22,37.32 68.21,38.32 68.21,41.32 | 68.21,41.32 68.21,44.16 | 68.21,41.32 U1.19 72.45,41.32 C24.1 | v59.69,114.26 LED16.A
  Top 0.559: LED3.5 LED3.6 | 81.39,9.52 LED10.4 80.85,9.32
  Top 0.61: U3.5 18.69,44.32 | LED3.5 LED3.4 LED2.6 LED2.5 LED2.4 19.25,2.97 17.47,4.75 LED1.6 LED1.5 LED1.4 13.22,9.32 12.38,10.16 12.38,17.62 18.69,23.93 C15.1 18.69,40.96 | LED3.6 LED4.4 LED4.5 LED4.6 LED5.4 LED5.5 LED5.6 LED6.4 LED6.5 LED6.6 LED7.4 LED7.5 LED7.6 LED8.4 LED8.5 LED8.6 LED9.4 LED9.5 LED9.6 78.85,2.97 81.58,5.7 LED10.4 LED10.5 LED10.6 | 80.85,9.32 v79.69,10.48 | v19.37,95.57 19.37,107 18.41,107.95 18.41,113.44 19.23,114.26 LED26.A LED25.A LED24.A LED23.A LED22.A LED21.A LED20.A LED19.A LED18.A LED17.A 57.76,114.3 61.85,114.3 LED16.A LED15.A LED14.A LED13.A LED12.A | LED27.A v12.7,90.49 | 33.91,66.01 L1.1 34.27,60.58 31.43,57.74 31.43,52.96 | 33.91,66.01 30.52,69.41 v22.51,69.41 U$10.P$3 | C6.1 25.35,53.45 25.84,52.96 IC3.3 31.43,52.96 | U2.5 18.69,40.96 | 18.69,40.96 18.69,44.32 | 18.69,44.32 C16.1 20.99,46.45 23.62,43.81 29.84,43.81 31.43,45.4 31.43,52.96 | C29.1 33.91,64.9 33.91,66.01
  Bottom 0.305: v87.57,76.14 87.57,75.66 91.09,72.14 R13.1 | R13.1 R14.1 R15.1 R16.1 91.08,64.06 v90.65,63.63 | v59.69,101.6 v59.69,114.26 | v80.01,26.54 80.01,20.32 79.47,19.78 v78.17,19.78 78.17,17.24 v76.99,16.07 76.2,15.27 8-BIT-DIP.2 | v85.66,31.37 JTAG1.2 | v68.58,16.64 8-BIT-DIP.5
  Bottom 0.61: R13.1 | v79.69,10.48 78.74,11.43 8-BIT-DIP.1 8-BIT-DIP.2 8-BIT-DIP.3 8-BIT-DIP.4 8-BIT-DIP.5 8-BIT-DIP.6 8-BIT-DIP.7 8-BIT-DIP.8 | v19.37,95.57 19.37,94.93 15.88,91.44 13.65,91.44 v12.7,90.49 12.7,75.66 14.76,73.6 21.97,73.6 22.51,73.06 v22.51,69.41
5.0V  (via drill 0.33)
  Top 0.305: 73.2,58.48 U5.1 v71.75,60.96 | v68.58,64.13 68.58,66.99 67.94,67.63 67.94,71.49 68.26,71.49
  Top 0.559: v69.19,72.72 69.22,72.69 C11.1
  Top 0.61: IC1.2 42.52,69.88 43.37,69.03 C4.1 53.18,69.03 57.12,65.09 59.69,65.09 66.1,71.49 68.26,71.49 C11.1 | 73.2,58.48 C27.1
  Bottom 0.305: v71.75,60.96 v68.58,64.13
  Bottom 0.559: MAX7221.VCC 69.22,72.69 v69.19,72.72
  Bottom 0.61: R11.1 68.06,72.72 v69.19,72.72
12V
  Top 0.406: 40.23,71.47 IC1.3
  Top 0.61: 17.94,72.39 17.94,67.91 18.99,66.87 U$10.P$1 C28.2 | IC1.3 40.21,71.75 C3.2 35.88,71.75 35.24,72.39 17.94,72.39 | 17.94,72.39 JP6.6 | JP6.5
  Top 0.813: JP6.6 JP6.5
CAN_RX  (via drill 0.33)
  Top 0.305: U1.95 66.71,33.11 66.04,33.78 v63.98,33.78 | v28.86,50.42 IC3.1
  Bottom 0.305: v63.98,33.78 63.25,33.78 56.8,40.23 33.78,40.23 32.67,41.34 32.67,49.59 31.84,50.42 v28.86,50.42
CAN_TX  (via drill 0.33)
  Top 0.305: U1.96 67.21,33.27 65.85,34.64 v63.98,34.64 | v28.7,54.23 IC3.4
  Bottom 0.305: v63.98,34.64 63.06,34.64 56.99,40.7 33.97,40.7 33.15,41.53 33.15,52.96 31.88,54.23 v28.7,54.23
CANJUMP1
  Top 0.305: JP6.1 13.49,62.39 13.97,61.91 13.97,56.8 19.08,51.69 | 19.08,51.69 IC3.7 | 19.08,51.69 19.02,51.62 19.02,49.59 22.7,45.91 JP7.1
CANJUMP2
  Top 0.305: R1.2 25.81,48.45 JP7.2
DIP1  (via drill 0.33)
  Top 0.305: R21.1 v60.96,24.42 59.71,25.66 U1.81
  Bottom 0.305: 8-BIT-DIP.9 v60.96,24.42
DIP2  (via drill 0.33)
  Top 0.305: R22.1 v63.5,24.45 62.86,25.08 61.05,25.08 60.21,25.92 U1.82
  Bottom 0.305: 8-BIT-DIP.10 v63.5,24.45
DIP3  (via drill 0.33)
  Top 0.305: R23.1 v66.04,24.45 64.42,24.45 63.31,25.56 61.25,25.56 60.71,26.09 U1.83
  Bottom 0.305: 8-BIT-DIP.11 v66.04,24.45
DIP4  (via drill 0.33)
  Top 0.305: R24.1 v68.58,24.45 66.96,24.45 66.29,25.11 64.42,25.11 63.5,26.04 61.44,26.04 61.21,26.26 U1.84
  Bottom 0.305: 8-BIT-DIP.12 v68.58,24.45
DIP5  (via drill 0.33)
  Top 0.305: R25.1 v71.12,24.45 69.5,24.45 68.83,25.11 66.96,25.11 66.48,25.59 64.61,25.59 63.69,26.51 62.01,26.51 61.71,26.8 U1.85
  Bottom 0.305: 8-BIT-DIP.13 v71.12,24.45
DIP6  (via drill 0.33)
  Top 0.305: R26.1 v73.66,24.45 72.04,24.45 71.37,25.11 69.5,25.11 68.99,25.62 67.12,25.62 66.67,26.07 64.8,26.07 63.88,26.99 62.48,26.99 62.21,27.26 U1.86
  Bottom 0.305: v73.66,24.45 8-BIT-DIP.14
DIP7  (via drill 0.33)
  Top 0.305: R27.1 v76.2,24.45 74.58,24.45 73.91,25.11 72.04,25.11 71.56,25.59 69.69,25.59 69.18,26.1 67.31,26.1 66.87,26.54 64.99,26.54 64.07,27.46 62.96,27.46 62.71,27.71 U1.87
  Bottom 0.305: 8-BIT-DIP.15 v76.2,24.45
DIP8  (via drill 0.33)
  Top 0.305: R28.1 v78.74,24.45 77.12,24.45 76.45,25.11 74.58,25.11 74.1,25.59 72.23,25.59 71.75,26.07 69.88,26.07 69.37,26.57 67.53,26.57 67.09,27.02 65.18,27.02 64.26,27.94 63.44,27.94 63.21,28.16 U1.88
  Bottom 0.305: 8-BIT-DIP.16 v78.74,24.45
GND  (via drill 0.33)
  Top 0.305: U1.74 54.25,32.82 | 54.25,32.82 54.23,32.8 | 54.25,32.82 53.09,32.82 53.09,32.83 C19.2 | 69.37,41.81 U1.20 69.34,41.82 69.34,42.29 | PCA9685.1 61.53,100.9 61.59,100.97 62.86,100.97 | U1.37 63.72,47.28 | U1.10 72.29,36.82 72.29,36.48 | PCA9685-2.25 71.08,16.88 70.99,16.8 | U1.99 68.71,32.35 68.36,32.7 | U1.27 68.71,44.48 v69.15,44.04
  Top 0.406: 56.83,101.6 56.82,101.61 PCA9685.25 54.62,101.61 54.61,101.6 | LED11.2 53.34,101.92 | PCA9685.1 60.36,99.66 60.32,99.69 | PCA9685-1.2 26.44,19.77 26.03,19.37 | 26.35,18.1 26.63,17.82 PCA9685-1.5 29.49,17.82 29.53,17.78 | PCA9685-1.24 31.47,17.82 31.43,17.78 | PCA9685-2.5 67.27,16.23 67.31,16.19 | 67.31,17.46 67.24,17.53 PCA9685-2.3 64.84,17.53 64.77,17.46 | PCA9685-2.25 73.29,16.88 73.34,16.83
  other vias: 59.69,59.37 72.23,61.94 16.83,85.09 61.59,108.9 63.82,74.3 46.99,85.09 51.12,85.09 39.69,85.09 35.24,85.09 25.4,85.09 59.05,85.09 63.82,85.09 68.58,85.09 73.03,85.09 79.38,85.09 82.55,85.09 16.07,41.02 16.13,44.39 63.21,38.32 16.45,50.42 24.38,52.32 24.7,57.72 66.36,66.99 69.53,66.99 72.71,66.99 69.12,42.35 70.64,45.91 72.14,47.82 69.18,40.54 69.18,39.53 57.25,36.04 57.31,38.26 57.31,41.59 57.25,43.43 75.09,31.56 79.34,45.02 67.82,56.04 70.17,55.15 62.86,56.32 46.35,70.2 46.35,71.15 46.35,72.1 47.31,72.1 47.31,71.15 47.31,70.2 48.26,70.2 48.26,71.15 49.21,70.2 16.67,66.87 16.67,68.14 16.67,69.41 16.67,70.68 13.49,70.68 13.49,69.41 13.49,68.14 13.49,66.87 7.14,66.23 7.14,67.18 7.14,68.14 7.14,69.09 34.86,38.35 66.23,60.48 71.95,63.98 75.44,63.98 75.44,66.2 72.71,53.24 73.98,54.51 74.93,56.42 58.71,29.31 63.75,32.73 20.42,31.43 17.24,31.4 17.11,37.31 15.05,38.93 13.78,40.51 20.54,37.62 23.02,37.56 26.61,37.53 24.51,33.21 26.29,33.59 17.37,28.7 20.29,28.57 16.95,26 20.45,26.13 84.01,54.77 84.01,57.31
  pour Top: 99.06,77.79 99.06,61.91 99.06,59.69 arc-29 83.82,0 15.24,0 8.89,12.7 arc-15 3.17,29.21 arc-8 0,53.34 arc-7 0,59.05 0,99.06 arc-90 17.14,116.2 83.82,116.2 arc-19 87.63,115.57 arc-20 93.34,112.39 arc-59 99.06,97.79
  pour Bottom: 99.06,77.79 99.06,61.91 99.06,59.69 arc-29 83.82,0 15.24,0 8.89,12.7 arc-15 3.17,29.21 arc-8 0,53.34 arc-7 0,59.05 0,99.06 arc-90 17.14,116.2 83.82,116.2 arc-19 93.34,112.39 arc-59 99.06,97.79
JTAG-TCK  (via drill 0.33)
  Top 0.305: U1.76 57.21,29.56 v57.05,29.4 | v82.84,43.4 JTAG1.9
  Bottom 0.305: v57.05,29.4 58.04,28.42 59.85,28.42 60.1,28.16 75.6,28.16 81.47,34.04 81.47,42.04 v82.84,43.4
JTAG-TDI  (via drill 0.33)
  Top 0.305: U1.77 v57.72,27.21 | v82.8,38.32 JTAG1.5
  Bottom 0.305: v82.8,38.32 82.42,37.94 82.42,33.66 75.98,27.21 v57.72,27.21
JTAG-TDO  (via drill 0.33)
  Top 0.305: U1.89 63.71,29.54 v64.17,29.08 | v82.77,48.48 JTAG1.13
  Bottom 0.305: v64.17,29.08 64.61,28.64 75.41,28.64 80.99,34.23 80.99,46.7 v82.77,48.48
JTAG-TMS  (via drill 0.33)
  Top 0.305: U1.72 56.97,33.82 v56.99,33.84 | v82.74,40.86 JTAG1.7
  Bottom 0.305: 56.99,31.94 v56.99,33.84 56.99,30.26 56.36,29.62 56.36,29.18 57.59,27.94 59.66,27.94 59.91,27.69 75.79,27.69 81.95,33.84 81.95,40.07 v82.74,40.86
LC
  Top 0.305: U3.6 20.94,45.26 21.43,44.77 21.43,43.72 23.33,41.82 U1.56
N$1
  Top 0.305: U1.13 75.34,38.32 Q1.1 C2.2
N$2
  Top 0.305: U1.12 75.48,37.82 Q1.2 C1.2
N$3  (via drill 0.33)
  Top 0.406: v53.34,78.74 53.34,86.36 v52.07,87.63
  Top 0.559: U$2.A 20.29,87.63 v20.32,87.63 | U$3.A 29.82,87.63 v29.84,87.63 | U$4.A 39.34,87.66 v39.37,87.63 | U$6.A 63.5,92.56 v63.5,87.63 | U$7.A 73.03,92.56 v73.03,87.63 | U$8.A 82.55,92.56 v82.55,87.63 | U$5.A v52.07,87.63
  Bottom 0.559: v20.32,87.63 v29.84,87.63 v39.37,87.63 | v39.37,87.63 40,87.63 | v39.37,87.63 v52.07,87.63 v63.5,87.63 v73.03,87.63 v82.55,87.63 | MAX7221.SEG_A 62.86,71.12 55.25,78.74 v53.34,78.74
N$4  (via drill 0.33)
  Top 0.305: v63.82,66.93 64.07,66.67 64.07,62.07 64.74,61.4 67.44,61.4 67.94,60.9 U5.4
  Bottom 0.305: v63.82,66.93 62.04,66.93 61.59,67.37 MAX7221.CLK
N$5  (via drill 0.33)
  Top 0.305: v61.59,55.78 61.94,55.44 64.45,55.44 65.37,56.36 65.37,58.45
  Top 0.61: U5.6 65.37,58.45
  Bottom 0.305: v61.59,55.78 MAX7221.LOAD
N$6  (via drill 0.33)
  Top 0.305: v66.36,75.25 66.36,82.55 66.67,82.87 66.67,85.09 v65.41,86.36
  Top 0.559: U$2.B 22.22,92.54 v22.22,86.36 | U$8.B 84.46,92.54 v84.46,86.36 | U$6.B 65.41,92.54 v65.41,86.36 | U$7.B 74.93,92.54 v74.93,86.36 | U$5.B v54.61,86.36 | U$3.B 31.7,86.41 v31.75,86.36 | U$4.B 41.22,86.41 v41.28,86.36
  Bottom 0.559: v22.22,86.36 v31.75,86.36 v41.28,86.36 v54.61,86.36 v65.41,86.36 v74.93,86.36 v84.46,86.36 | MAX7221.SEG_B 65.41,74.3 v66.36,75.25
N$7  (via drill 0.33)
  Top 0.305: v75.56,62.23 74.8,62.99 71.25,62.99 70.48,62.23 U5.2
  Bottom 0.305: v75.56,62.23 MAX7221.DIN
N$8  (via drill 0.33)
  Top 0.559: U$2.C 20.32,77.62 v20.32,82.55 | U$3.C 29.84,77.62 v29.84,82.55 | U$4.C 39.37,77.62 v39.37,82.55 | U$5.C v52.07,82.55 | U$6.C 63.5,77.62 v63.5,82.55 | v73.03,82.55 73,82.53 U$7.C 73.03,77.56 v73.03,74.93 | U$8.C 82.55,77.62 v82.55,82.55
  Bottom 0.559: v20.32,82.55 v29.84,82.55 v39.37,82.55 v52.07,82.55 v63.5,82.55 v73.03,82.55 v82.55,82.55 | MAX7221.SEG_C 70.48,72.39 v73.03,74.93
N$9
  Top 0.305: 74.29,111.35 74.29,110.49 67.37,103.56 PCA9685.7
  Top 0.406: 74.29,111.35 LED13.C
N$10
  Top 0.305: U1.73 54.18,33.32 C19.1
N$11
  Top 0.305: LED14.C 69.85,111.16 69.85,110.49 63.57,104.21 PCA9685.8
N$12  (via drill 0.33)
  Top 0.559: U$2.D 16.51,77.62 v16.51,81.28 | v69.22,81.28 69.24,81.25 U$7.D | U$3.D 26.03,77.62 v26.03,81.28 | v46.99,81.28 U$5.D | U$6.D 59.69,77.62 v59.69,81.28 | v79.38,81.28 79.38,79.69 78.74,79.06 78.74,77.62 U$8.D 78.74,77.56 v78.74,74.93 | v35.56,81.28 35.58,81.25 U$4.D 35.56,77.62 v35.56,81.28
  Bottom 0.559: v79.38,81.28 v69.22,81.28 v59.69,81.28 v46.99,81.28 v35.56,81.28 v26.03,81.28 v16.51,81.28 | MAX7221.SEG_D 74.29,70.48 v78.74,74.93
N$13  (via drill 0.33)
  Top 0.559: U$2.E 14.6,77.64 v14.6,80.01 | v44.45,80.01 U$5.E | v76.83,80.01 76.88,79.96 U$8.E 76.83,77.54 v76.83,74.93 | U$3.E 24.13,77.64 v24.13,80.01 | v33.66,80.01 33.7,79.96 U$4.E | U$6.E 57.78,77.64 v57.78,80.01 | U$7.E 67.31,77.64 v67.31,80.01
  Bottom 0.559: v14.6,80.01 v24.13,80.01 v33.66,80.01 v44.45,80.01 v57.78,80.01 v67.31,80.01 v76.83,80.01 | MAX7221.SEG_E 71.75,71.75 74.29,74.3 76.2,74.3 v76.83,74.93
N$14  (via drill 0.33)
  Top 0.559: U$2.F 16.51,92.56 v16.51,88.9 | U$3.F 26.06,88.9 v26.03,88.9 | U$4.F 35.58,88.92 v35.56,88.9 | U$6.F 59.69,92.56 v59.69,88.9 | U$8.F 78.74,92.56 v78.74,88.9 | U$7.F 69.22,92.56 v69.22,88.9 | U$5.F v46.99,88.9 | v56.51,79.06 v56.51,88.9
  Bottom 0.559: v16.51,88.9 v26.03,88.9 v35.56,88.9 v46.99,88.9 v56.51,88.9 v59.69,88.9 v69.22,88.9 v78.74,88.9 | MAX7221.SEG_F 64.13,71.44 v56.51,79.06
N$15  (via drill 0.33)
  Top 0.559: U$2.G 14.6,92.54 v14.6,90.17 | U$3.G 24.18,90.17 v24.13,90.17 | U$4.G 33.7,90.22 v33.66,90.17 | U$6.G 57.78,92.54 v57.78,90.17 | U$7.G 67.31,92.54 v67.31,90.17 | U$8.G 76.83,92.54 v76.83,90.17 76.83,85.72 78.1,84.45 v78.1,80.01 | U$5.G v44.45,90.17
  Bottom 0.559: v14.6,90.17 v24.13,90.17 v33.66,90.17 v44.45,90.17 v57.78,90.17 v67.31,90.17 v76.83,90.17 | MAX7221.SEG_G 66.67,73.66 69.85,76.84 75.56,76.84 78.1,79.38 v78.1,80.01
N$16  (via drill 0.33)
  Top 0.559: v18.41,75.56 U$2.GND U$2.GND2
  Bottom 0.559: MAX7221.DIG0 74.29,64.77 73.03,66.04 61.59,66.04 60.32,67.31 60.32,72.07 56.83,75.56 v18.41,75.56
N$17  (via drill 0.33)
  Top 0.559: U$3.GND2 U$3.GND v27.94,74.61
  Bottom 0.559: MAX7221.DIG1 62.86,61.59 62.23,62.23 60.32,62.23 56.51,66.04 56.51,70.8 54.61,72.71 49.21,72.71 48.26,73.66 37.15,73.66 36.19,74.61 v27.94,74.61
N$18  (via drill 0.33)
  Top 0.559: U$4.GND2 U$4.GND v37.47,74.61
  Bottom 0.559: MAX7221.DIG2 69.22,62.23 67.31,64.13 60.96,64.13 58.42,66.67 58.42,71.44 55.25,74.61 v37.47,74.61
N$19  (via drill 0.33)
  Top 0.559: U$5.GND U$5.GND2 v49.53,73.66
  Bottom 0.559: MAX7221.DIG3 67.94,62.23 66.99,63.18 60.64,63.18 57.47,66.36 57.47,71.12 54.93,73.66 v49.53,73.66
N$20  (via drill 0.33)
  Top 0.559: U$6.GND2 U$6.GND 61.59,74.93 59.37,72.71 v59.37,66.99
  Bottom 0.559: MAX7221.DIG4 73.03,64.45 72.39,65.09 61.28,65.09 v59.37,66.99
N$21  (via drill 0.33)
  Top 0.559: U$7.GND2 U$7.GND
  Top 0.61: U$7.GND 71.12,65.09 68.29,62.26 v66.04,62.26
  Bottom 0.559: MAX7221.DIG5 64.13,60.33 v66.04,62.26
N$22  (via drill 0.33)
  Top 0.559: U$8.GND2 U$8.GND
  Top 0.61: v76.68,58.42 76.68,71.37 80.64,75.34 U$8.GND
  Bottom 0.61: MAX7221.DIG6 70.48,56.2 71.12,55.56 75.47,55.56 76.68,56.77 v76.68,58.42
N$23
  Top 0.305: LED15.C 65.98,107.57 63.27,104.86 PCA9685.9
N$24
  Top 0.305: U1.49 57.71,47.28 C20.1
N$25  (via drill 0.33)
  Top 0.559: U$2.DP 22.22,77.64 v22.22,83.82 | U$3.DP 31.75,77.64 v31.75,83.82 | U$4.DP 41.28,77.64 v41.28,83.82 | U$5.DOT v54.61,83.82 | U$6.DP 65.41,77.64 v65.41,83.82 | v74.93,83.82 74.88,83.77 U$7.DP 74.93,77.54 v74.93,73.03 | U$8.DP 84.46,77.64 v84.46,83.82
  Bottom 0.559: v22.22,83.82 v31.75,83.82 v41.28,83.82 v54.61,83.82 v65.41,83.82 v74.93,83.82 v84.46,83.82 | MAX7221.SEG_DP 73.03,71.12 v74.93,73.03
N$26  (via drill 0.33)
  Top 0.305: X1.3 v17.14,33.66 | R2.2 20.32,33.34 v20,33.66
  Bottom 0.305: v17.14,33.66 v20,33.66
N$27
  Bottom 0.559: MAX7221.ISET R11.2
N$28  (via drill 0.33)
  Top 0.305: X1.2 v17.46,34.61 | v20,34.92 R3.2
  Bottom 0.305: v17.46,34.61 19.69,34.61 v20,34.92
N$29
  Top 0.305: LED11.5 R19.1
N$30  (via drill 0.33)
  Top 0.305: R4.2 S1.P$1 26.85,31.82 v26.86,32.77 | U1.94 66.21,29.7 v66.61,29.3
  Bottom 0.305: v66.61,29.3 65.5,29.3 60.29,34.51 56.71,34.51 54.96,32.77 v26.86,32.77
N$32
  Top 0.305: LED11.6 45,100.32 R29.1
N$33
  Top 0.305: LED11.4 45,103.52 R6.1
N$34
  Top 0.305: LED16.C 63.21,111.42 63.5,111.12 63.5,106.05 62.97,105.51 PCA9685.10
N$35
  Top 0.305: 57.78,111.35 57.78,110.17 58.1,109.86 62.55,109.86 62.86,109.54 62.86,106.36 62.66,106.16 PCA9685.11
  Top 0.406: 57.78,111.35 LED17.C
N$36
  Top 0.305: PCA9685.12 58.29,106.81 56.2,108.9 55.25,108.9 53.66,110.49 53.66,111.35
  Top 0.406: 53.66,111.35 LED18.C
N$37
  Top 0.305: PCA9685.13 58.59,107.46 56.51,109.54 55.88,109.54 55.25,110.17 55.25,112.39 54.83,112.81 50.86,112.81 LED19.C
N$38
  Top 0.305: 45.4,110.81 46.04,110.17 53.02,110.17 55.08,108.11 PCA9685.15
  Top 0.406: 45.4,110.81 45.4,111.35 LED20.C
N$39
  Top 0.305: 41.28,111.35 41.28,110.49 42.23,109.54 52.7,109.54 54.78,107.46 PCA9685.16
  Top 0.406: 41.28,111.35 LED21.C
N$40
  Top 0.305: PCA9685.17 54.48,106.81 52.39,108.9 38.73,108.9 37.15,110.49 37.15,111.35 LED22.C
N$41
  Top 0.305: 33.02,111.35 33.02,110.49 35.24,108.27 52.07,108.27 54.18,106.16 PCA9685.18
  Top 0.406: 33.02,111.35 LED23.C
N$42
  Top 0.305: 28.89,111.35 28.89,110.49 31.75,107.63 51.75,107.63 53.87,105.51 PCA9685.19
  Top 0.406: 28.89,111.35 LED24.C
N$43
  Top 0.305: 24.76,111.35 24.76,110.49 28.26,107 51.44,107 53.57,104.86 PCA9685.20
  Top 0.406: 24.76,111.35 LED25.C
N$44
  Top 0.305: 20.64,111.35 20.64,110.49 24.76,106.36 51.12,106.36 53.27,104.21 PCA9685.21
  Top 0.406: 20.64,111.35 LED26.C
N$45
  Top 0.305: PCA9685-1.6 16.5,17.17 14.28,14.94 LED1.3
N$46
  Top 0.61: U$10.P$2 24.47,68.14 L1.2 23.97,65.16 23.97,64.52 | 23.78,63.69 23.97,63.88 23.97,64.52 | D2.C 22.35,62.9 23.97,64.52
N$48
  Top 0.305: PCA9685-1.7 17.56,16.52 15.88,14.83 LED1.2
N$49
  Top 0.305: PCA9685-1.8 18.5,15.87 17.47,14.84 LED1.1
N$50
  Top 0.305: PCA9685-1.9 25.06,15.22 21.27,11.43 21.27,7.25
  Top 0.406: 21.27,7.25 LED2.3
N$51
  Top 0.305: JP6.2 13.08,64.39 14.6,62.86 14.6,57.15 18.76,52.96 IC3.6 22.73,52.96 23.37,52.32 23.34,52.3 R1.1
N$52
  Top 0.305: PCA9685-1.10 25.36,14.57 22.86,12.07 LED2.2
N$53
  Top 0.305: PCA9685-1.11 25.66,13.92 24.46,12.71 LED2.1
N$54
  Top 0.305: PCA9685-1.12 26.28,13.27 25.72,12.7 25.72,11.11 26.35,10.48 28.57,10.48 28.88,10.17 LED3.3
N$55
  Top 0.305: PCA9685-1.13 26.59,12.62 26.35,12.38 26.35,11.43 26.67,11.11 29.84,11.11 30.48,10.48 LED3.2
N$56
  Top 0.305: PCA9685-1.15 32.6,11.97 32.08,11.44 LED3.1
N$57
  Top 0.305: PCA9685-1.16 34.69,12.62 36.5,10.81 LED4.3
N$58
  Top 0.305: 78.42,111.35 78.42,110.49 70.84,102.91 PCA9685.6
  Top 0.406: 78.42,111.35 LED12.C
N$59
  Top 0.305: PCA9685-1.17 34.99,13.27 38.1,10.16 LED4.2
N$60
  Top 0.305: PCA9685-1.18 35.29,13.92 39.7,9.51 LED4.1
N$61
  Top 0.305: PCA9685-1.19 38.14,14.57 44.12,8.59 LED5.3
N$62
  Top 0.305: PCA9685-1.20 39.07,15.22 45.72,8.57 LED5.2
N$63
  Top 0.305: PCA9685-1.21 40.01,15.87 47.32,8.56 LED5.1
N$64
  Top 0.305: PCA9685-2.6 58.76,15.58 51.74,8.56 LED6.3
N$65
  Top 0.305: PCA9685-2.7 59.7,14.93 53.34,8.57 LED6.2
N$66
  Top 0.305: PCA9685-2.8 60.63,14.28 54.94,8.59 LED6.1
N$67
  Top 0.305: PCA9685-2.9 64.11,13.63 59.36,8.88 LED7.3
N$68
  Top 0.305: PCA9685-2.10 64.41,12.98 60.96,9.52 LED7.2
N$69
  Top 0.305: PCA9685-2.11 64.72,12.33 62.56,10.17 LED7.1
N$70
  Top 0.305: PCA9685-2.12 65.02,11.68 64.13,10.8 64.13,9.52 64.77,8.89 66.67,8.89 66.98,8.59 LED8.3
N$71
  Top 0.305: PCA9685-2.13 65.32,11.03 64.77,10.48 64.77,9.84 65.09,9.52 67.63,9.52 68.58,8.57 LED8.2
N$72
  Top 0.305: PCA9685-2.15 71.02,10.38 70.18,9.54 LED8.1
N$73
  Top 0.305: PCA9685-2.16 73.42,11.03 74.6,9.86 LED9.3
N$74
  Top 0.305: PCA9685-2.17 73.73,11.68 76.2,9.21 LED9.2
N$75
  Top 0.305: PCA9685-2.18 74.03,12.33 77.8,8.56 LED9.1
N$76
  Top 0.305: PCA9685-2.19 81.58,12.98
  Top 0.406: 81.58,12.98 LED10.3
N$77
  Top 0.305: PCA9685-2.20 79.35,13.63 80.96,15.24 82.87,15.24 83.19,14.92 LED10.2
N$78
  Top 0.305: PCA9685-2.21 79.05,14.28 80.64,15.88 83.82,15.88 84.77,14.92 84.77,13.6
  Top 0.406: 84.77,13.6 LED10.1
N$80  (via drill 0.33)
  Top 0.305: LED27.C 8.1,92.24 8.25,92.39 v12.38,92.39 | v57.47,103.5 57.41,103.56 PCA9685.22
  Bottom 0.305: v12.38,92.39 14.29,92.39 20,98.11 52.07,98.11 v57.47,103.5
N$85
  Top 0.305: U3.3 15.58,43.38 13.91,45.05 13.91,53.66 12.49,55.07 TC1.2
N$86
  Top 0.305: PAD1.3 12.6,45.34 16.05,41.9 U2.1
N$87
  Top 0.305: U2.3 15.7,40.02 12.38,43.34 PAD1.2
N$88
  Top 0.305: U3.1 15.03,45.26 14.51,45.78 14.51,54.36 1.91,66.96 1.91,79.22 4.33,81.65 TC2.2
N$90
  Top 0.305: U4.1 88.51,82.31 88.85,82.66 TC3.2
N$94  (via drill 0.33)
  other vias: 9.53,101.6
N$95  (via drill 0.33)
  other vias: 89.53,101.6
N$96  (via drill 0.33)
  other vias: 49.53,53.98
N$97  (via drill 0.33)
  other vias: 49.53,19.05
NEUT
  Top 0.305: U3.4 21.1,43.38 23.16,41.32 U1.57
PADDOWN
  Top 0.305: U2.4 21.86,40.02 22.17,40.32 U1.59
PADUP
  Top 0.305: U2.6 20.97,41.9 22.04,40.82 U1.58
RESET  (via drill 0.33)
  Top 0.305: S2.P$1 37.81,30.93 | 37.81,30.93 R5.1 | v69.25,38.64 69.43,38.82 U1.14 74.16,38.82 74.61,39.27 74.61,45.75 79.88,51.02 JTAG1.15 | v37.81,33.59 37.81,30.93
  Bottom 0.305: v69.25,38.64 69.25,34.42 66.39,31.56 63.91,31.56 60.48,34.99 56.51,34.99 54.77,33.24 38.16,33.24 v37.81,33.59
ROTSW1  (via drill 0.33)
  Top 0.305: ROT1.6 v88.33,64.96 82.14,64.96 81.31,64.13 81.31,56.13 73.69,48.51 68.07,48.51 67.71,48.16 U1.29
  Bottom 0.305: v88.33,64.96 R16.2
ROTSW2  (via drill 0.33)
  Top 0.305: ROT1.5 88.46,66.96 v88.33,66.96 82.55,66.96 80.84,65.25 80.84,56.33 73.5,48.99 67.88,48.99 67.21,48.32 U1.30
  Bottom 0.305: v88.33,66.96 R15.2
ROTSW3  (via drill 0.33)
  Top 0.305: ROT1.4 88.42,68.96 v88.33,68.96 81.85,68.96 80.36,67.47 80.36,56.52 73.31,49.47 67.69,49.47 66.71,48.49 U1.31
  Bottom 0.305: v88.33,68.96 R14.2
ROTSW4  (via drill 0.33)
  Top 0.305: ROT1.3 v88.33,70.96 80.8,70.96 79.88,70.04 79.88,56.71 73.15,49.97 67.53,49.97 66.21,48.66 U1.32
  Bottom 0.305: v88.33,70.96 R13.2
SCL  (via drill 0.33)
  Top 0.305: PCA9685.26 54.61,100.96 53.97,100.33 53.97,98.74 55.25,97.47 v78.42,97.47 | PCA9685-2.26 v70.68,17.53 | v73.95,18.83 74.14,18.64 75.29,18.64 | 75.29,18.64 78.45,18.64 79.98,20.16 79.98,24.83 79.69,25.11 77.12,25.11 76.64,25.59 74.77,25.59 74.29,26.07 72.42,26.07 71.94,26.54 70.07,26.54 69.56,27.05 67.72,27.05 67.28,27.5 65.47,27.5 65.21,27.75 U1.92 65.21,32.1 v65.09,32.23 | R18.1 75.29,18.64 | PCA9685-1.26 35.81,19.12 v35.88,19.05
  Bottom 0.305: v78.42,97.47 85.9,90 85.9,77.33 81.91,73.34 79.38,73.34 77.79,71.75 77.79,56.99 65.09,44.29 v65.09,32.23 | v73.95,18.83 71.98,18.83 v70.68,17.53 60.71,17.53 58.74,15.56 58.74,13.65 54.61,9.52 45.4,9.52 v35.88,19.05
SDA  (via drill 0.33)
  Top 0.305: PCA9685.27 54.91,100.31 54.61,100.01 54.61,99.06 55.25,98.42 79.06,98.42 v80.01,97.47 | 75.29,18.18 PCA9685-2.27 69.93,18.18 v69.85,18.18 | 75.29,18.18 78.66,18.18 80.45,19.97 80.45,25.02 79.88,25.59 77.31,25.59 76.83,26.07 74.96,26.07 74.49,26.54 72.61,26.54 72.14,27.02 70.26,27.02 69.75,27.53 67.91,27.53 67.47,27.97 65.91,27.97 65.71,28.17 U1.93 65.71,31.9 v66.04,32.23 | R17.1 75.29,18.18 | PCA9685-1.27 36.43,19.77 v36.83,19.37
  Bottom 0.305: v80.01,97.47 86.99,90.49 86.99,77.47 81.91,72.39 80.01,72.39 78.74,71.12 78.74,57.15 66.04,44.45 v66.04,32.23 | v36.83,19.37 46.04,10.16 54.29,10.16 58.1,13.97 58.1,15.88 60.41,18.18 v69.85,18.18
SLBLUE  (via drill 0.33)
  Top 0.305: R29.2 42.48,100.3 42.26,100.08 42.26,97.66 43.28,96.65 43.28,74.39 43.5,74.17 48.07,74.17 52.32,69.91 v52.32,69.85 | v59.75,53.28 62.21,50.82 U1.40
  Bottom 0.305: v52.32,69.85 52.32,65.18 59.34,58.17 59.34,53.69 v59.75,53.28
SLGREEN  (via drill 0.33)
  Top 0.305: R19.2 42.35,101.92 41.78,101.35 41.78,97.47 42.8,96.46 42.8,74.2 43.31,73.69 47.88,73.69 51.44,70.14 v51.44,69.85 | v59.12,52.58 61.21,50.48 U1.42
  Bottom 0.305: v51.44,69.85 51.44,65.41 58.86,57.98 58.86,52.83 v59.12,52.58
SLRED  (via drill 0.33)
  Top 0.305: R6.2 42.45,103.54 41.31,102.39 41.31,97.28 42.32,96.27 42.32,74.01 43.12,73.22 47.69,73.22 50.48,70.42 v50.48,69.85 | v58.39,51.98 60.21,50.15 U1.44
  Bottom 0.305: v50.48,69.85 50.48,65.69 58.39,57.78 v58.39,51.98
SPI-LOAD  (via drill 0.33)
  Top 0.305: U1.51 v53.21,44.32 | v64.1,56.26 64.13,56.29 U5.7
  Bottom 0.305: v53.21,44.32 53.21,45.37 v64.1,56.26
SPI-MOSI  (via drill 0.33)
  Top 0.305: U1.54 54.33,42.82 v54.29,42.83 | v69.18,55.82 69.22,55.85 U5.3
  Bottom 0.305: v54.29,42.83 54.55,43.09 54.55,45.37 63.98,54.8 68.17,54.8 v69.18,55.82
SPI-SCK  (via drill 0.33)
  Top 0.305: U1.52 54.05,43.82 v53.88,43.66 | U5.5 66.64,58.45 v66.64,55.47
  Bottom 0.305: v53.88,43.66 53.88,45.37 63.98,55.47 v66.64,55.47
TCTEMPOFF
  Top 0.305: U4.6 88.51,75.97 86.23,73.69 81.5,73.69 79.41,71.6 79.41,56.9 72.96,50.45 67.34,50.45 65.71,48.82 U1.33
USB_DM
  Top 0.305: R3.1 23.81,34.92 23.91,34.82 U1.70
USB_DP
  Top 0.305: R2.1 23.18,33.66 23.84,34.32 U1.71
USB_ID  (via drill 0.33)
  Top 0.305: X1.4 v16.06,32.54 | v19.81,35.75 19.84,35.78 23.62,35.78 24.08,35.32 U1.69
  Bottom 0.305: v16.06,32.54 16.06,34.2 17.27,35.4 19.46,35.4 v19.81,35.75
USB_VBUS  (via drill 0.33)
  Top 0.305: X1.1 14.6,34.61 14.92,34.92 C26.1 16.21,35.64 v16.22,35.66 | v20.51,36.45 20.7,36.26 23.81,36.26 24.25,35.82 U1.68
  Bottom 0.305: v16.22,35.66 17.02,36.45 v20.51,36.45

### Text on the board
tSilk: BOOT0 | RESET